# Altium project SIPROKAR_Mainboard.PrjPcb
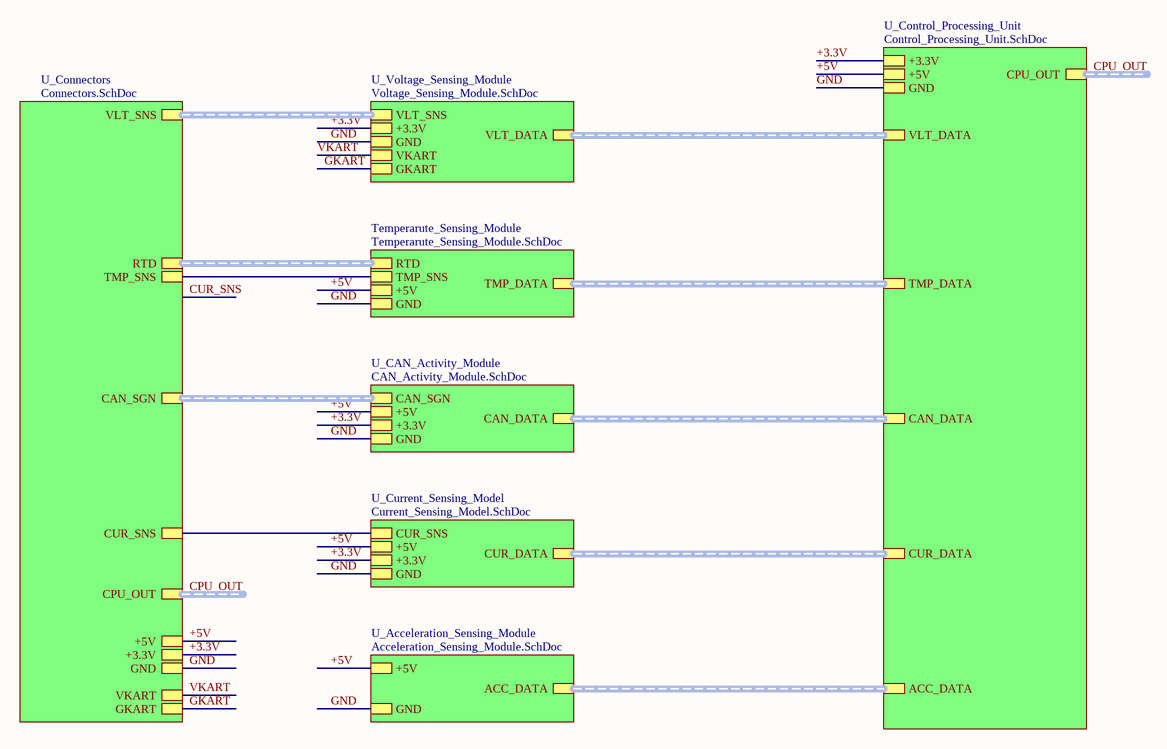
[diagram p0: Top_Level.SchDoc]
14 sheets, 185 parts. Net scope: hierarchical (ports join the sheet entries above them; power ports are global).
Board files: MainboardV2.PcbDoc, Mainboard.PcbDoc
Sheets:
  Top_Level.SchDoc
    U_Control_Processing_Unit = Control_Processing_Unit.SchDoc
    U_Current_Sensing_Model = Current_Sensing_Model.SchDoc
      Interface_Current_Sensor_1 = Interface_Current_Sensor_1.SchDoc
      U_Interface_Current_Sensor_2 = Interface_Current_Sensor_2.SchDoc
    U_CAN_Activity_Module = CAN_Activity_Module.SchDoc
      Interface_CAN_1 = Interface_CAN.SchDoc
      Interface_CAN_2 = Interface_CAN.SchDoc
    U_Connectors = Connectors.SchDoc
    U_Voltage_Sensing_Module = Voltage_Sensing_Module.SchDoc
      Interface_Voltage_Sensor_2 = Interface_Voltage_Sensor_1.SchDoc
      nterface_Voltage_Sensor_1 = Interface_Voltage_Sensor_1.SchDoc
  Interface_Accelerometer_1.SchDoc
  Interface_Accelerometer_2.SchDoc
  Interace_PT100.SchDoc
  Interface_DS18B20.SchDoc

## Sheet Top_Level.SchDoc
size A4

### Sub-sheets
Temperarute_Sensing_Module = Temperarute_Sensing_Module.SchDoc (file not in this document): GND, +5V, TMP_DATA (harness TEMP), RTD, TMP_SNS
U_Acceleration_Sensing_Module = Acceleration_Sensing_Module.SchDoc (file not in this document): GND, +5V, ACC_DATA (harness ACCELERATION DATA)
U_CAN_Activity_Module = CAN_Activity_Module.SchDoc: GND, +5V, +3.3V, CAN_DATA (harness CAN DATA), CAN_SGN (harness *)
U_Connectors = Connectors.SchDoc: CUR_SNS, RTD (harness *), TMP_SNS, VLT_SNS (harness VLT SENSE), +5V, +3.3V, GND, GKART, VKART, CAN_SGN (harness CAN SIGNALS), CPU_OUT (harness CPU)
U_Control_Processing_Unit = Control_Processing_Unit.SchDoc: TMP_DATA (harness TEMPERATURE), CUR_DATA (harness CURRENT), ACC_DATA (harness ACCELERATION), CAN_DATA (harness BUS CAN), +3.3V, +5V, GND, VLT_DATA (harness VOLTAGE DATA), CPU_OUT (harness CPU)
U_Current_Sensing_Model = Current_Sensing_Model.SchDoc: GND, +5V, CUR_DATA (harness CURRENT DATA), +3.3V, CUR_SNS
U_Voltage_Sensing_Module = Voltage_Sensing_Module.SchDoc: GND, VLT_DATA (harness VOLTAGE DATA), +3.3V, VKART, GKART, VLT_SNS

### Nets
+3.3V: sheet U_Control_Processing_Unit/+3.3V, sheet U_Current_Sensing_Model/+3.3V, sheet U_CAN_Activity_Module/+3.3V, sheet U_Connectors/+3.3V, sheet U_Voltage_Sensing_Module/+3.3V
+5V: sheet Temperarute_Sensing_Module/+5V, sheet U_Control_Processing_Unit/+5V, sheet U_Acceleration_Sensing_Module/+5V, sheet U_Current_Sensing_Model/+5V, sheet U_CAN_Activity_Module/+5V, sheet U_Connectors/+5V
GKART: sheet U_Connectors/GKART, sheet U_Voltage_Sensing_Module/GKART
GND: sheet Temperarute_Sensing_Module/GND, sheet U_Control_Processing_Unit/GND, sheet U_Acceleration_Sensing_Module/GND, sheet U_Current_Sensing_Model/GND, sheet U_CAN_Activity_Module/GND, sheet U_Connectors/GND, sheet U_Voltage_Sensing_Module/GND
VKART: sheet U_Connectors/VKART, sheet U_Voltage_Sensing_Module/VKART  [project net KVCC]
CUR_2_VAL: sheet U_Current_Sensing_Model/CUR_SNS, sheet U_Connectors/CUR_SNS
DATA: sheet Temperarute_Sensing_Module/TMP_SNS, sheet U_Connectors/TMP_SNS

### Buses and harness runs
harness CPU_OUT = sheet U_Connectors/CPU_OUT
harness CPU_OUT = sheet U_Control_Processing_Unit/CPU_OUT
harness sheet Temperarute_Sensing_Module/RTD = sheet U_Connectors/RTD
harness sheet Temperarute_Sensing_Module/TMP_DATA = sheet U_Control_Processing_Unit/TMP_DATA
harness sheet U_Acceleration_Sensing_Module/ACC_DATA = sheet U_Control_Processing_Unit/ACC_DATA
harness sheet U_CAN_Activity_Module/CAN_DATA = sheet U_Control_Processing_Unit/CAN_DATA
harness sheet U_CAN_Activity_Module/CAN_SGN = sheet U_Connectors/CAN_SGN
harness sheet U_Connectors/VLT_SNS = sheet U_Voltage_Sensing_Module/VLT_SNS
harness sheet U_Control_Processing_Unit/CUR_DATA = sheet U_Current_Sensing_Model/CUR_DATA
harness sheet U_Control_Processing_Unit/VLT_DATA = sheet U_Voltage_Sensing_Module/VLT_DATA

## Sheet Control_Processing_Unit.SchDoc
size A2
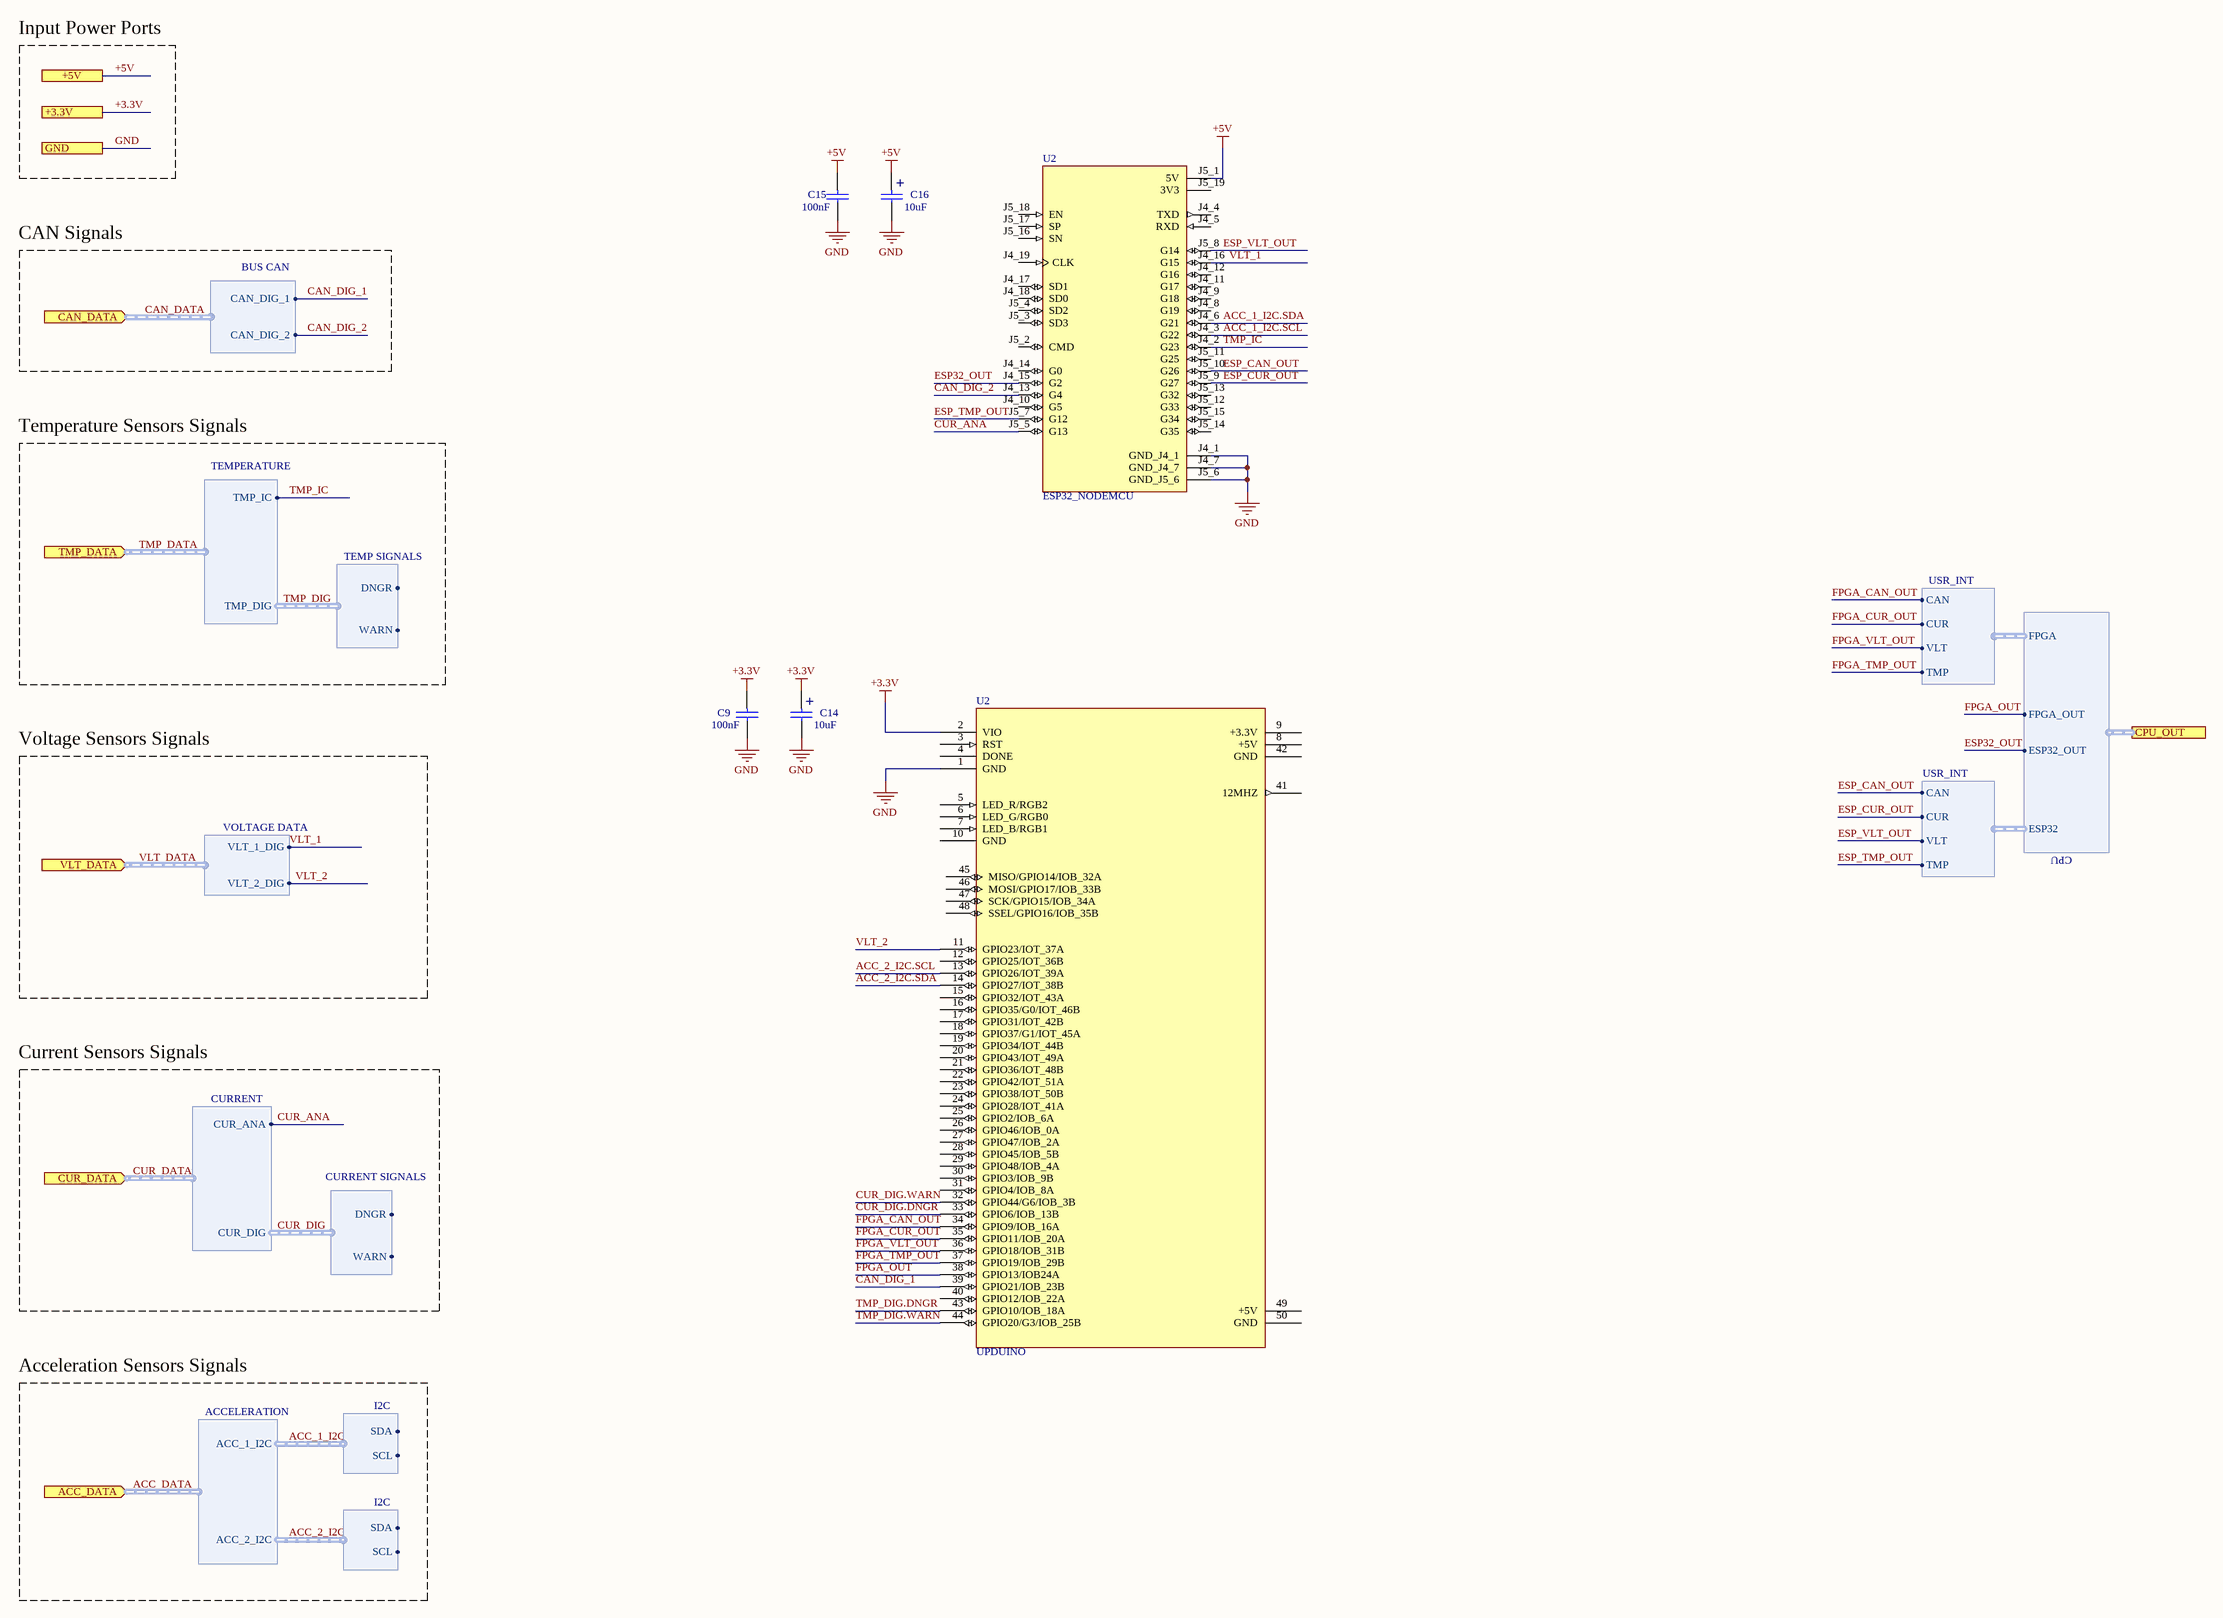
[diagram p1: Control_Processing_Unit.SchDoc]

### Parts
(Parts that share a designator on the sheet are numbered #1, #2 ... from top to bottom, then left to right.)
C9  100nF  [CAP200]
C14  10uF  [CAP100RP]
C15  100nF  [CAP200]
C16  10uF  [CAP100RP]
U2#1  ESP32_NODEMCU  [MODULE_ESP32_NODEMCU]
U2#2  UPDUINO  [UPDUINO]

### Ports
+3.3V, +5V, ACC_DATA (in, harness ACCELERATION), CAN_DATA (in, harness BUS CAN), CPU_OUT (harness CPU), CUR_DATA (in, harness CURRENT), GND, TMP_DATA (in, harness TEMPERATURE), VLT_DATA (in, harness VOLTAGE DATA)

### Harnesses
TEMPERATURE: TMP_DIG, TMP_IC
VOLTAGE DATA: VLT_2_DIG, VLT_1_DIG
CURRENT SIGNALS: WARN, DNGR
CURRENT: CUR_DIG, CUR_ANA
I2C: SCL, SDA
ACCELERATION: ACC_2_I2C, ACC_1_I2C
BUS CAN: CAN_DIG_2, CAN_DIG_1
TEMP SIGNALS: WARN, DNGR
USR_INT: CUR, VLT, TMP, CAN
CPU: FPGA, ESP32, ESP32_OUT, FPGA_OUT

### Nets
+3.3V: C9.1 C14.1 U2#2.2(VIO) ; port +3.3V
+5V: C15.1 C16.1 U2#1.J5_1(5V) ; port +5V
GND: C9.2 C14.2 C15.2 C16.2 U2#1.J4_1(GND_J4_1) U2#1.J4_7(GND_J4_7) U2#1.J5_6(GND_J5_6) U2#2.1(GND) ; port GND
ACC_1_I2C.SCL: U2#1.J4_3(G22)
ACC_1_I2C.SDA: U2#1.J4_6(G21)
ACC_2_I2C.SCL: U2#2.13(GPIO26/IOT_39A)
ACC_2_I2C.SDA: U2#2.14(GPIO27/IOT_38B)
CAN_DIG_1: U2#2.39(GPIO21/IOB_23B)
CAN_DIG_2: U2#1.J4_13(G4)
CUR_ANA: U2#1.J5_5(G13) ; port CUR_DATA.CUR_ANA  [project net CUR_1_VAL]
CUR_DIG.DNGR: U2#2.33(GPIO6/IOB_13B)
CUR_DIG.WARN: U2#2.32(GPIO44/G6/IOB_3B)
ESP32_OUT: U2#1.J4_15(G2)
ESP_CAN_OUT: U2#1.J5_10(G26) ; harness USR_INT.CAN
ESP_CUR_OUT: U2#1.J5_9(G27) ; harness USR_INT.CUR
ESP_TMP_OUT: U2#1.J5_7(G12) ; harness USR_INT.TMP
ESP_VLT_OUT: U2#1.J5_8(G14) ; harness USR_INT.VLT
FPGA_CAN_OUT: U2#2.34(GPIO9/IOB_16A) ; harness USR_INT.CAN
FPGA_CUR_OUT: U2#2.35(GPIO11/IOB_20A) ; harness USR_INT.CUR
FPGA_OUT: U2#2.38(GPIO13/IOB24A)
FPGA_TMP_OUT: U2#2.37(GPIO19/IOB_29B) ; harness USR_INT.TMP
FPGA_VLT_OUT: U2#2.36(GPIO18/IOB_31B) ; harness USR_INT.VLT
TMP_DIG.DNGR: U2#2.43(GPIO10/IOB_18A)
TMP_DIG.WARN: U2#2.44(GPIO20/G3/IOB_25B)
TMP_IC: U2#1.J4_2(G23) ; port TMP_DATA.TMP_IC  [project net TMP_DATA.TMP_IC]
VLT_1: U2#1.J4_16(G15) ; port VLT_DATA.VLT_1_DIG
VLT_2: U2#2.11(GPIO23/IOT_37A)

Not connected (* = marked no-connect by the designer): U2#1 J4_4(TXD) J4_5(RXD) J4_8(G19) J4_9(G18) J4_10(G5) J4_11(G17) J4_12(G16) J4_14(G0) J4_17(SD1) J4_18(SD0) J4_19(CLK) J5_2(CMD) J5_3(SD3) J5_4(SD2) J5_11(G25) J5_12(G33) J5_13(G32) J5_14(G35) J5_15(G34) J5_16(SN) J5_17(SP) J5_18(EN) J5_19(3V3); U2#2 3(RST) 4(DONE) 5(LED_R/RGB2) 6(LED_G/RGB0) 7(LED_B/RGB1) 8(+5V) 9(+3.3V) 10(GND) 12(GPIO25/IOT_36B) 15(GPIO32/IOT_43A) 16(GPIO35/G0/IOT_46B) 17(GPIO31/IOT_42B) 18(GPIO37/G1/IOT_45A) 19(GPIO34/IOT_44B) 20(GPIO43/IOT_49A) 21(GPIO36/IOT_48B) 22(GPIO42/IOT_51A) 23(GPIO38/IOT_50B) 24(GPIO28/IOT_41A) 25(GPIO2/IOB_6A) 26(GPIO46/IOB_0A) 27(GPIO47/IOB_2A) 28(GPIO45/IOB_5B) 29(GPIO48/IOB_4A) 30(GPIO3/IOB_9B) 31(GPIO4/IOB_8A) 40(GPIO12/IOB_22A) 41(12MHZ) 42(GND) 45(MISO/GPIO14/IOB_32A) 46(MOSI/GPIO17/IOB_33B) 47(SCK/GPIO15/IOB_34A) 48(SSEL/GPIO16/IOB_35B) 49(+5V) 50(GND)

### Buses and harness runs
harness ACC_DATA = port ACC_DATA
harness CAN_DATA = port CAN_DATA
harness CUR_DATA = port CUR_DATA
harness TMP_DATA = port TMP_DATA
harness VLT_DATA = port VLT_DATA

### Notes on the sheet
- Input Power Ports
- CAN Signals
- Temperature Sensors Signals
- Voltage Sensors Signals
- Current Sensors Signals
- Acceleration Sensors Signals
- (in symbol CMP-001-00092-1) +

### Library data of the parts
C9 C15 = CMP-001-00091-1: Source: Schematics.SchLib; Pins: 2; Design Item ID: CAP; Component Type: Standard
C14 C16 = CMP-001-00092-1: Source: Schematics.SchLib; Component Type: Standard; Pins: 2; Design Item ID: CAPPOL
U2#1 = CMP-027-000000-1: NodeMCU is an open source loT platform. ESP32 is a series of low cost, low powersystem-on-chip (SoC) microcontrollers with integrated Wi-Fi & dual-mode Bluetooth.; MF: Espressif Systems; MP: ESP32 NODEMCU; Package: Package; Design Item ID: ESP32_NODEMCU; Source: ESP32_NODEMCU.SchLib; Check_prices: https://www.snapeda.com/parts/ESP32%20NODEMCU/Espressif+Systems/view-part/?ref=eda; SnapEDA_Link: https://www.snapeda.com/parts/ESP32%20NODEMCU/Espressif+Systems/view-part/?ref=snap; Value: *; Pin Count: 38; Component Type: Standard
U2#2 = UPDUINO: Lattice UltraPlus ICE40UP5K FPGA with 5.3K LUTs, 1Mb SPRAM, 120Kb DPRAM, 8 Multipliers

## Sheet Current_Sensing_Model.SchDoc
size A4
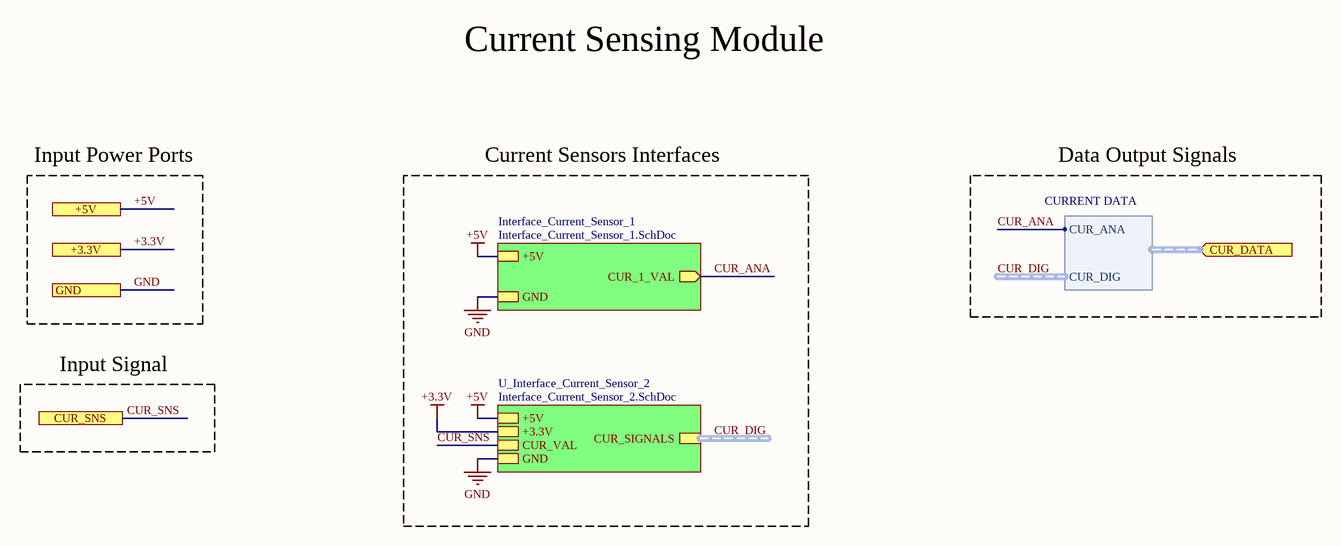
[diagram p2: Current_Sensing_Model.SchDoc]

### Sub-sheets
Interface_Current_Sensor_1 = Interface_Current_Sensor_1.SchDoc: GND, +5V, CUR_1_VAL (out)
U_Interface_Current_Sensor_2 = Interface_Current_Sensor_2.SchDoc: GND, +5V, +3.3V, CUR_SIGNALS (harness CURRENT SIGNALS), CUR_VAL

### Ports
+3.3V, +5V, CUR_DATA (in, harness CURRENT DATA), CUR_SNS, GND

### Harnesses
CURRENT DATA: CUR_ANA, CUR_DIG

### Nets
+3.3V: port +3.3V, sheet U_Interface_Current_Sensor_2/+3.3V
+5V: port +5V, sheet Interface_Current_Sensor_1/+5V, sheet U_Interface_Current_Sensor_2/+5V
GND: port GND, sheet Interface_Current_Sensor_1/GND, sheet U_Interface_Current_Sensor_2/GND
CUR_ANA: sheet Interface_Current_Sensor_1/CUR_1_VAL, port CUR_DATA.CUR_ANA  [project net CUR_1_VAL]
CUR_SNS: port CUR_SNS, sheet U_Interface_Current_Sensor_2/CUR_VAL  [project net CUR_2_VAL]

### Buses and harness runs
harness CUR_DIG = sheet U_Interface_Current_Sensor_2/CUR_SIGNALS

### Notes on the sheet
- Current Sensing Module
- Input Power Ports
- Current Sensors Interfaces
- Data Output Signals
- Input Signal

## Sheet Interface_Current_Sensor_1.SchDoc
size A4
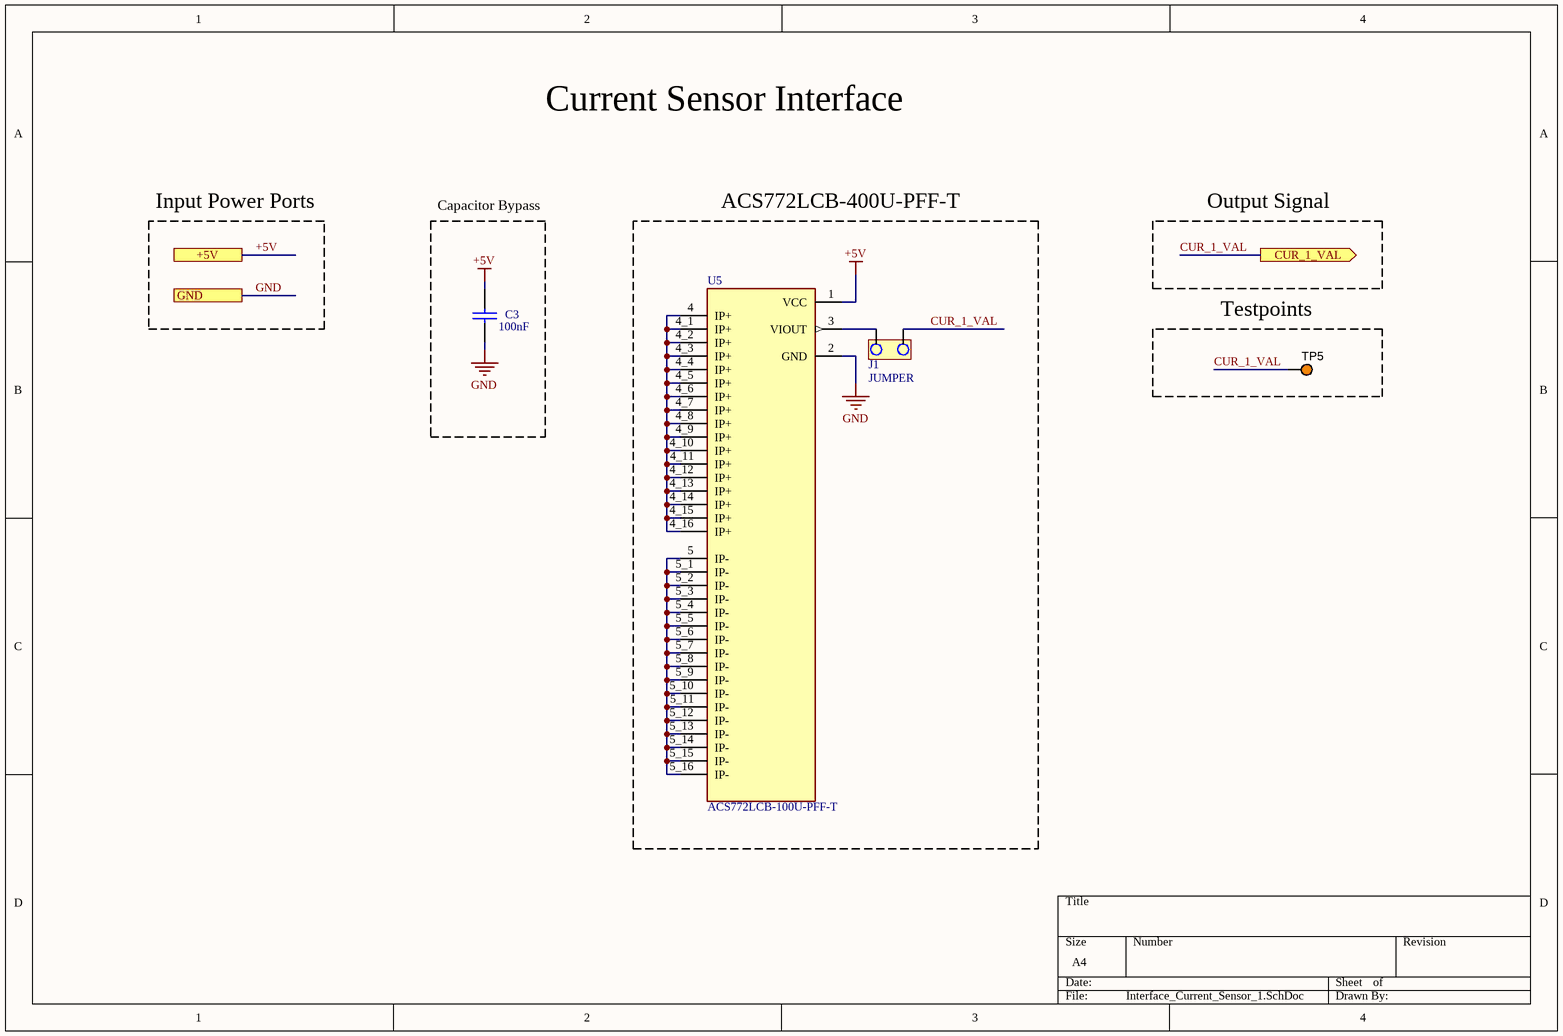
[diagram p3: Interface_Current_Sensor_1.SchDoc]

### Parts
C3  100nF  [CAP200]
J1  JUMPER  [JUMPER2]
TP5  5003  [KSTN-5003]  (value not drawn)
U5  ACS772LCB-100U-PFF-T  [XDCR_ACS772LCB-100U-PFF-T]

### Blocks framed on the sheet
Capacitor Bypass: C3
ACS772LCB-400U-PFF-T: J1 U5
Testpoints: TP5

### Ports
+5V, CUR_1_VAL (out), GND

### Nets
+5V: C3.1 U5.1(VCC) ; port +5V
GND: C3.2 U5.2(GND) ; port GND
CUR_1_VAL: J1.2 TP5.1 ; port CUR_1_VAL
NetJ1_1: J1.1 U5.3(VIOUT)
NetU5_4: U5.4(IP+) U5.4_1(IP+) U5.4_2(IP+) U5.4_3(IP+) U5.4_4(IP+) U5.4_5(IP+) U5.4_6(IP+) U5.4_7(IP+) U5.4_8(IP+) U5.4_9(IP+) U5.4_10(IP+) U5.4_11(IP+) U5.4_12(IP+) U5.4_13(IP+) U5.4_14(IP+) U5.4_15(IP+) U5.4_16(IP+)
NetU5_5: U5.5(IP-) U5.5_1(IP-) U5.5_2(IP-) U5.5_3(IP-) U5.5_4(IP-) U5.5_5(IP-) U5.5_6(IP-) U5.5_7(IP-) U5.5_8(IP-) U5.5_9(IP-) U5.5_10(IP-) U5.5_11(IP-) U5.5_12(IP-) U5.5_13(IP-) U5.5_14(IP-) U5.5_15(IP-) U5.5_16(IP-)

### Notes on the sheet
- Current Sensor Interface
- Input Power Ports
- Output Signal

### Library data of the parts
C3 = CAP
TP5 = CMP-002-00037-2: Test Point, Orange, Height 4.6 mm, Tail Length 3 mm, 1-Pin THD, RoHS; Manufacturer: Keystone; Colour: Orange; Packaging: Bulk; Package Description: 1-Pin Through Hole Device, Dia 2.54 mm; Pins: 1; Package Reference: 5003; Datasheet Version: Jun-15; Case/Package: 5003; Mounting Technology: TH; Connector Type: TestPoint; Diameter: 2.54mm; Contact Material: Bronze; Datasheet URL: http://keyelco.com/userAssets/file/M65p56.pdf; Manufacturer URL: http://www.keyelco.com/; Package Quantity: 10; Contact Plating: Tin; RoHS Compliant: True
U5 = CMP-029-000000-1: Current Sensor 100A 1 Channel Hall Effect Unidirectional 5-CB Formed Leads, PFF; MF: Allegro MicroSystems LLC; Check_prices: https://www.snapeda.com/parts/ACS772LCB-100U-PFF-T/Allegro%20MicroSystems%20LLC/view-part/2783431/?ref=eda; Availability: Bad; Arrow_Electronics-Purchase-URL: https://snapeda.com/shop?store=Arrow+Electronics&id=2783431; Value: *; Package: 5-CB-5 Allegro MicroSystems LLC; Source: ACS772LCB-100U-PFF-T.SchLib; Price: None; Design Item ID: ACS772LCB-100U-PFF-T; MP: ACS772LCB-100U-PFF-T; Pin Count: 37; Component Type: Standard; SnapEDA_Link: https://www.snapeda.com/parts/ACS772LCB-100U-PFF-T/Allegro%20MicroSystems%20LLC/view-part/2783431/?ref=snap

## Sheet Interface_Current_Sensor_2.SchDoc
size A3; SPICEModelCacheQYDFTYGO: <root> / <DocumentId>QYDFTYGO</DocumentId> / </root>
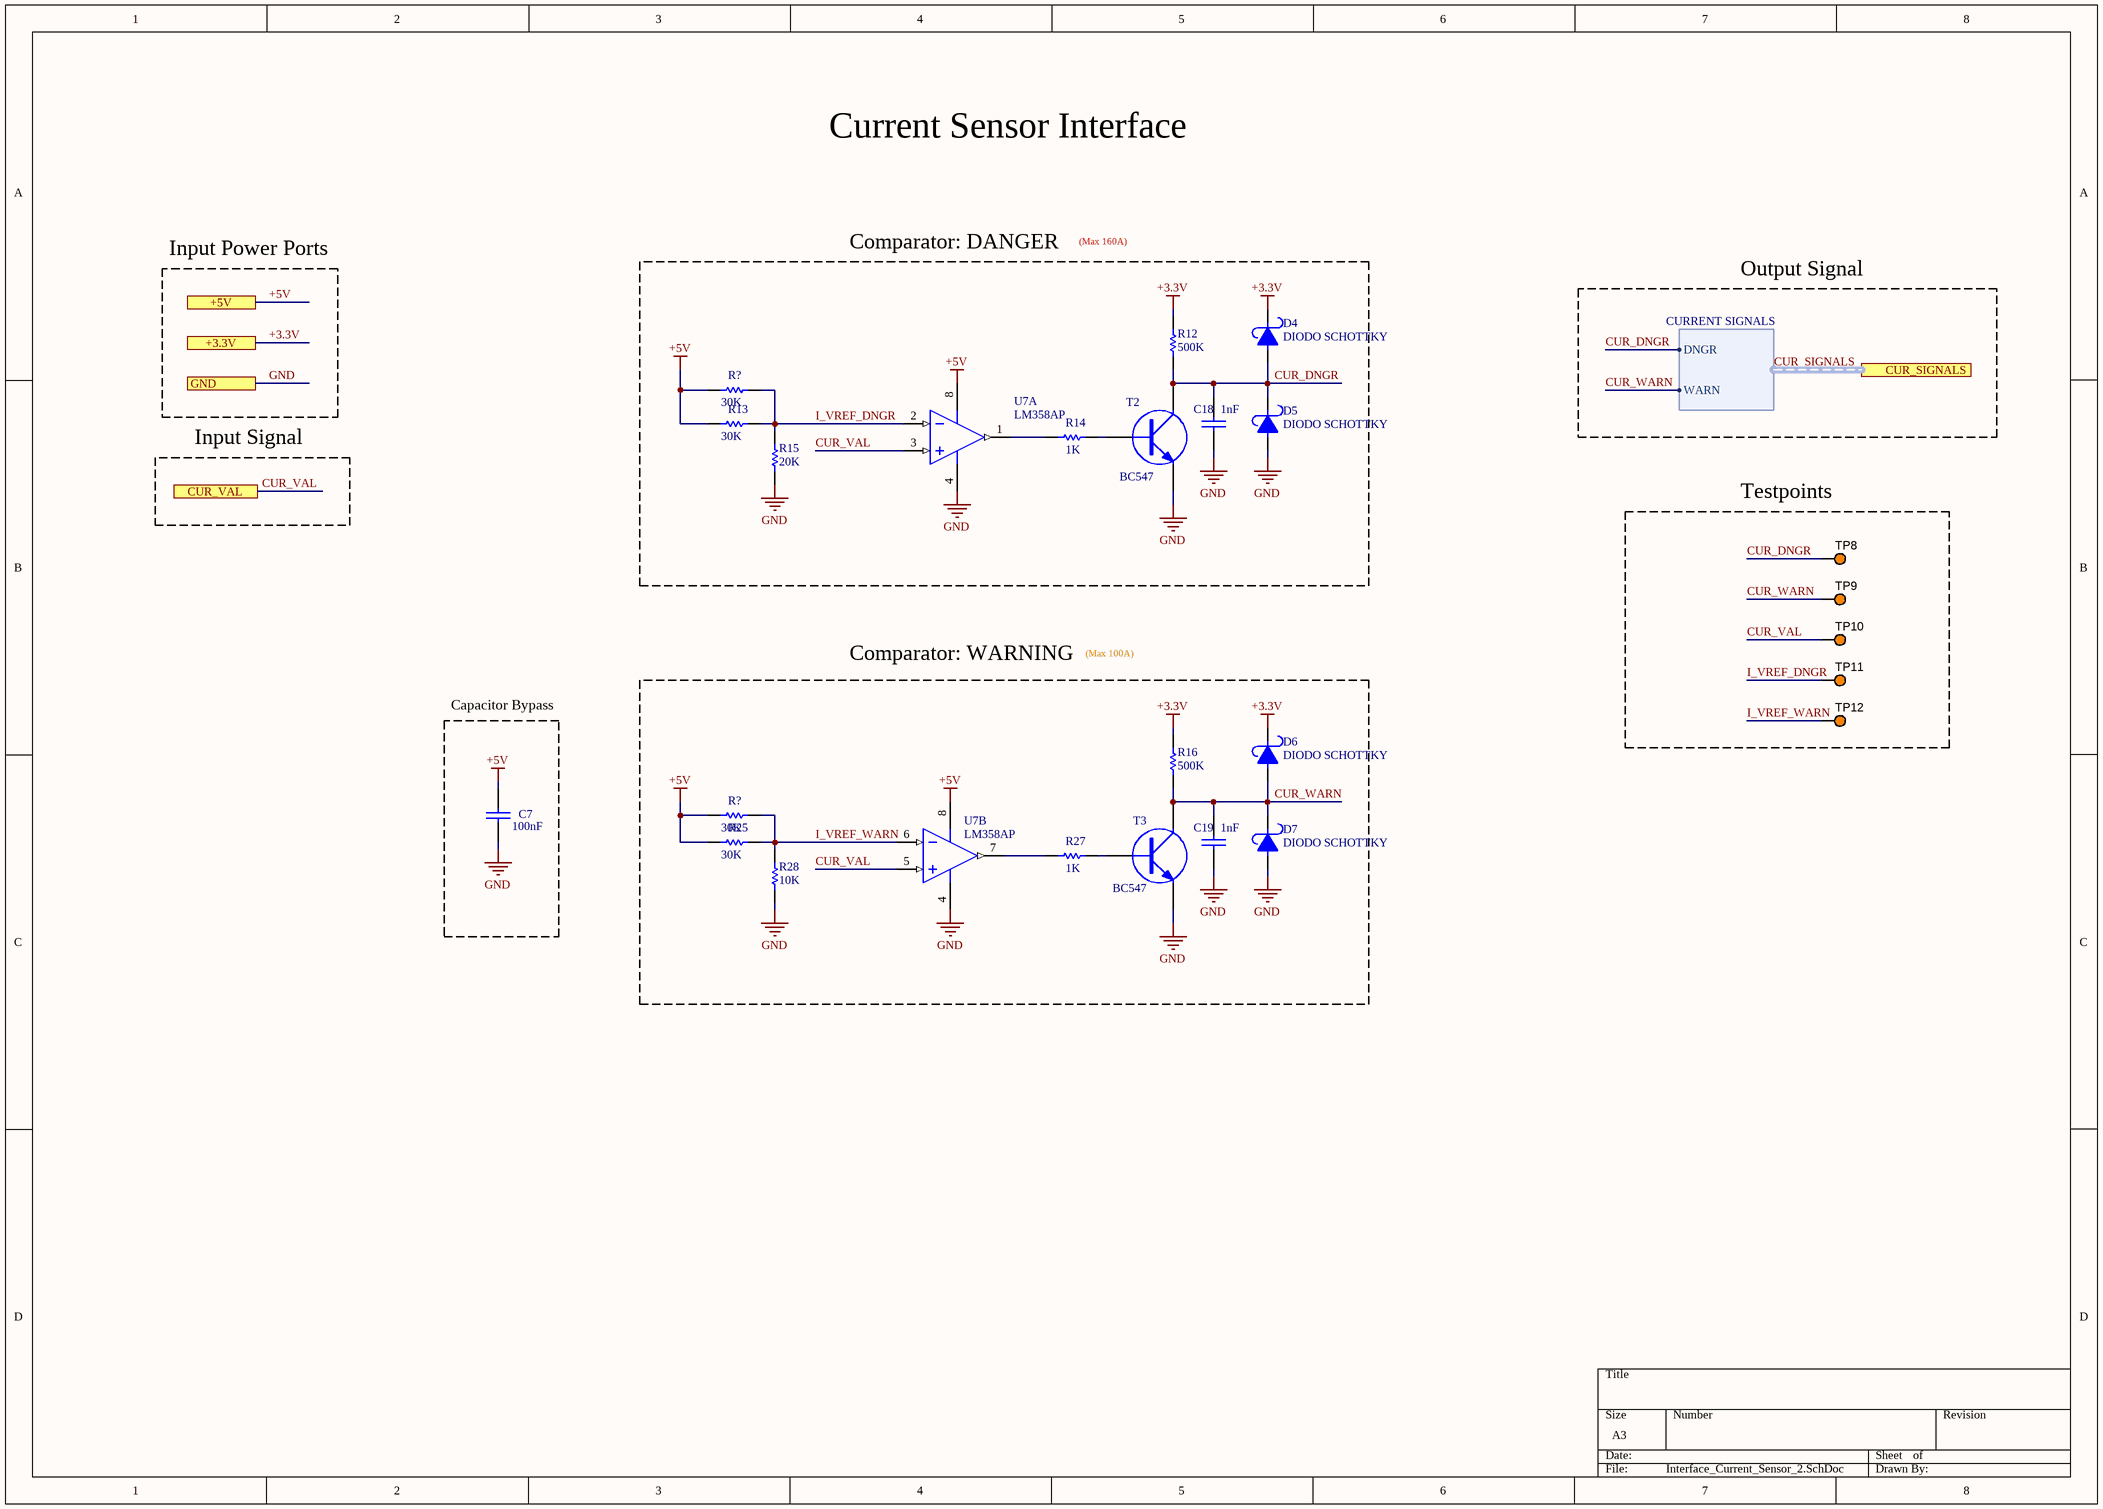
[diagram p4: Interface_Current_Sensor_2.SchDoc]

### Parts
(Parts that share a designator on the sheet are numbered #1, #2 ... from top to bottom, then left to right.)
C7  100nF  [CAP200]
C18  1nF  [CAP200]
C19  1nF  [CAP200]
D4  DIODO SCHOTTKY  [DO41]
D5  DIODO SCHOTTKY  [DO41]
D6  DIODO SCHOTTKY  [DO41]
D7  DIODO SCHOTTKY  [DO41]
R12  500K  [RES400]
R13  30K  [RES400]
R14  1K  [RES400]
R15  20K  [RES400]
R16  500K  [RES400]
R25  30K  [RES400]
R27  1K  [RES400]
R28  10K  [RES400]
R?#1  30K  [RES400]
R?#2  30K  [RES400]
T2  BC547  [TO92]
T3  BC547  [TO92]
TP8  5003  [KSTN-5003]  (value not drawn)
TP9  5003  [KSTN-5003]  (value not drawn)
TP10  5003  [KSTN-5003]  (value not drawn)
TP11  5003  [KSTN-5003]  (value not drawn)
TP12  5003  [KSTN-5003]  (value not drawn)
U7  LM358AP  [P0008A]  (parts A,B of 2)

### Blocks framed on the sheet
Comparator: DANGER: C18 D4 D5 R12-R15 R?#1 T2 U7
Testpoints: TP8-TP12
Comparator: WARNING: C19 D6 D7 R16 R25 R27 R28 R?#2 T3 U7
Capacitor Bypass: C7

### Ports
+3.3V, +5V, CUR_SIGNALS (harness CURRENT SIGNALS), CUR_VAL, GND

### Harnesses
CURRENT SIGNALS: DNGR, WARN

### Nets
+3.3V: D4.2 D6.2 R12.2 R16.2 ; port +3.3V
+5V: C7.1 R13.1 R25.1 R?#1.1 R?#2.1 U7.8(VCC) ; port +5V
GND: C7.2 C18.2 C19.2 D5.1 D7.1 R15.1 R28.1 T2.3(E) T3.3(E) U7.4(GND) ; port GND
CUR_DNGR: C18.1 D4.1 D5.2 R12.1 T2.2(C) TP8.1 ; port CUR_SIGNALS.DNGR  [project net CUR_DIG.DNGR]
CUR_VAL: TP10.1 U7.3(1IN+) U7.5(2IN+) ; port CUR_VAL  [project net CUR_2_VAL]
CUR_WARN: C19.1 D6.1 D7.2 R16.1 T3.2(C) TP9.1 ; port CUR_SIGNALS.WARN  [project net CUR_DIG.WARN]
I_VREF_DNGR: R13.2 R15.2 R?#1.2 TP11.1 U7.2(1IN-)
I_VREF_WARN: R25.2 R28.2 R?#2.2 TP12.1 U7.6(2IN-)
NetR14_1: R14.1 U7.1(1OUT)
NetR14_2: R14.2 T2.1(B)
NetR27_1: R27.1 U7.7(2OUT)
NetR27_2: R27.2 T3.1(B)

### Buses and harness runs
harness CUR_SIGNALS = port CUR_SIGNALS

### Notes on the sheet
- Current Sensor Interface
- (Max 160A)
- Input Power Ports
- Output Signal
- Input Signal
- (Max 100A)

### Library data of the parts
C7 C18 C19 = CAP
R12-R16 R25 R27 R28 R?#1 R?#2 = CMP-009-00195-1: Component Type: Standard; Source: Schematics.SchLib; Pins: 2; Design Item ID: RES
T2 T3 = CMP-012-00019-1: Component Type: Standard; Source: Schematics.SchLib; Design Item ID: TRANSISTOR NPN; Pins: 3
TP8-TP12 = CMP-002-00037-2: as TP5 on sheet Interface_Current_Sensor_1; Colour: Orange; Packaging: Bulk; Package Description: 1-Pin Through Hole Device, Dia 2.54 mm; Pins: 1; Package Reference: 5003; Datasheet Version: Jun-15; Case/Package: 5003; Mounting Technology: TH; Connector Type: TestPoint; Diameter: 2.54mm; Contact Material: Bronze; Datasheet URL: http://keyelco.com/userAssets/file/M65p56.pdf; Manufacturer URL: http://www.keyelco.com/; Package Quantity: 10; Contact Plating: Tin; RoHS Compliant: True
U7 = CMP-014-00023-2: Dual Operational Amplifier, 3 to 32 V, 0 to 70 degC, 8-Pin PDIP (P), Pb-Free (RoHS), Tube; Manufacturer: Texas Instruments (TI); Channels: 2; Max Dual Supply Voltage: 16V; Min Dual Supply Voltage: 1.5V; Slew Rate: 0.3V/us; Unity Gain Bandwidth Product: 700KHz; Common Mode Rejection Ratio: 65dB; Nominal Supply Voltage: 5V; Package Version: 4040082/E, 04/2010; Output Current: 30mA; Nominal Supply Current: 1.2mA; Nominal Voltage Gain: 100dB; Case/Package: DIP; Max Operating Temperature: 70°C; RoHS Compliant: True; Manufacturer URL: http://www.ti.com/; Pins: 8; Package Description: 8-Pin Double In-line Package, Body 9.59 x 6.35 mm, Pitch 2.54 mm; Datasheet URL: http://www.ti.com/lit/ds/symlink/lm358a.pdf; Max Supply Voltage: 16V; Package Reference: P0008A; Mounting Technology: TH; Min Operating Temperature: 0°C; Package URL: http://www.ti.com/lit/ml/mpdi001b/mpdi001b.pdf; Min Supply Voltage: 1.5V; Package Quantity: 50; Packaging: Rail/Tube; Datasheet Version: SLOS068T, 04/2015; Nominal Gain Bandwith Product: 700KHz

## Sheet CAN_Activity_Module.SchDoc
size A4; SPICEModelCacheIPUPPCIY: <root> / <DocumentId>IPUPPCIY</DocumentId> / </root>
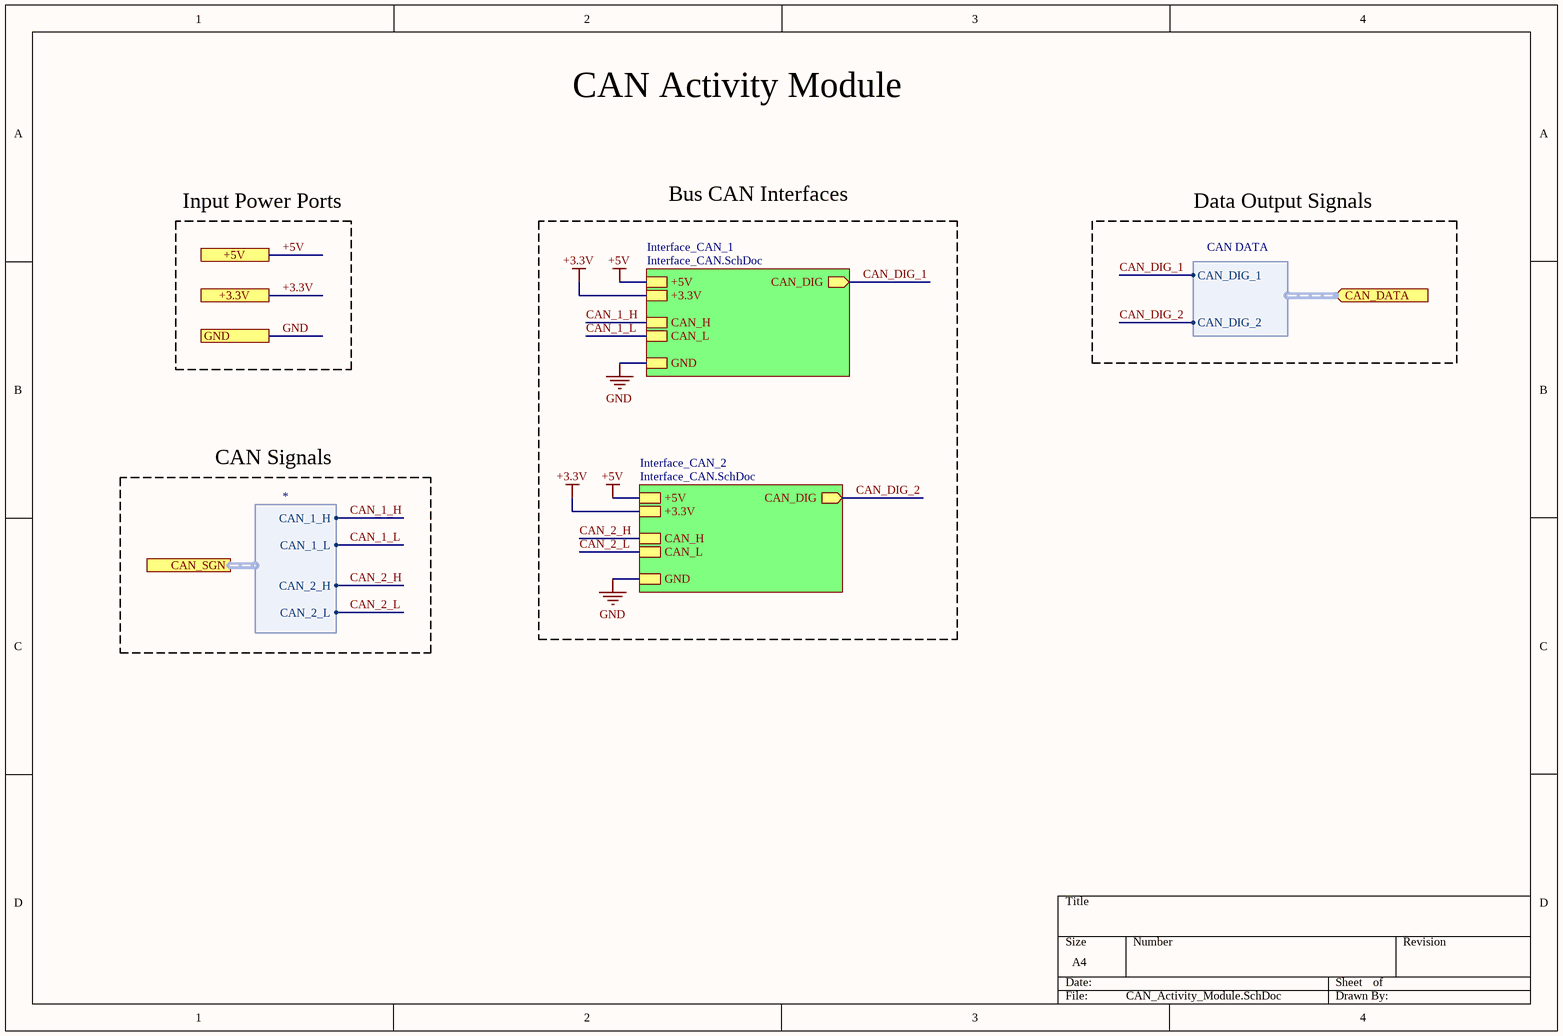
[diagram p5: CAN_Activity_Module.SchDoc]

### Sub-sheets
Interface_CAN_1 = Interface_CAN.SchDoc: GND, +5V, CAN_DIG (out), CAN_L, CAN_H, +3.3V
Interface_CAN_2 = Interface_CAN.SchDoc: GND, +5V, CAN_DIG (out), CAN_L, CAN_H, +3.3V

### Ports
+3.3V, +5V, CAN_DATA (in, harness CAN DATA), CAN_SGN (harness *), GND

### Harnesses
CAN DATA: CAN_DIG_1, CAN_DIG_2
*: CAN_1_H, CAN_1_L, CAN_2_H, CAN_2_L

### Nets
+3.3V: port +3.3V, sheet Interface_CAN_1/+3.3V, sheet Interface_CAN_2/+3.3V
+5V: port +5V, sheet Interface_CAN_1/+5V, sheet Interface_CAN_2/+5V
GND: port GND, sheet Interface_CAN_1/GND, sheet Interface_CAN_2/GND
CAN_1_H: sheet Interface_CAN_1/CAN_H, port CAN_SGN.CAN_1_H
CAN_1_L: sheet Interface_CAN_1/CAN_L, port CAN_SGN.CAN_1_L
CAN_2_H: sheet Interface_CAN_2/CAN_H, port CAN_SGN.CAN_2_H
CAN_2_L: sheet Interface_CAN_2/CAN_L, port CAN_SGN.CAN_2_L
CAN_DIG_1: sheet Interface_CAN_1/CAN_DIG, port CAN_DATA.CAN_DIG_1  [project net CAN_DATA.CAN_DIG_1]
CAN_DIG_2: sheet Interface_CAN_2/CAN_DIG, port CAN_DATA.CAN_DIG_2  [project net CAN_DATA.CAN_DIG_2]

### Notes on the sheet
- CAN Activity Module
- Input Power Ports
- Bus CAN Interfaces
- Data Output Signals
- CAN Signals

## Sheet Interface_CAN.SchDoc
size Legal; SPICEModelCacheOQIDUCOR: <root> / <DocumentId>OQIDUCOR</DocumentId> / </root>
Used 2 times, as channels U_CAN_Activity_Module/Interface_CAN_1, U_CAN_Activity_Module/Interface_CAN_2. Parts and nets are listed once, with the designators drawn on the sheet.
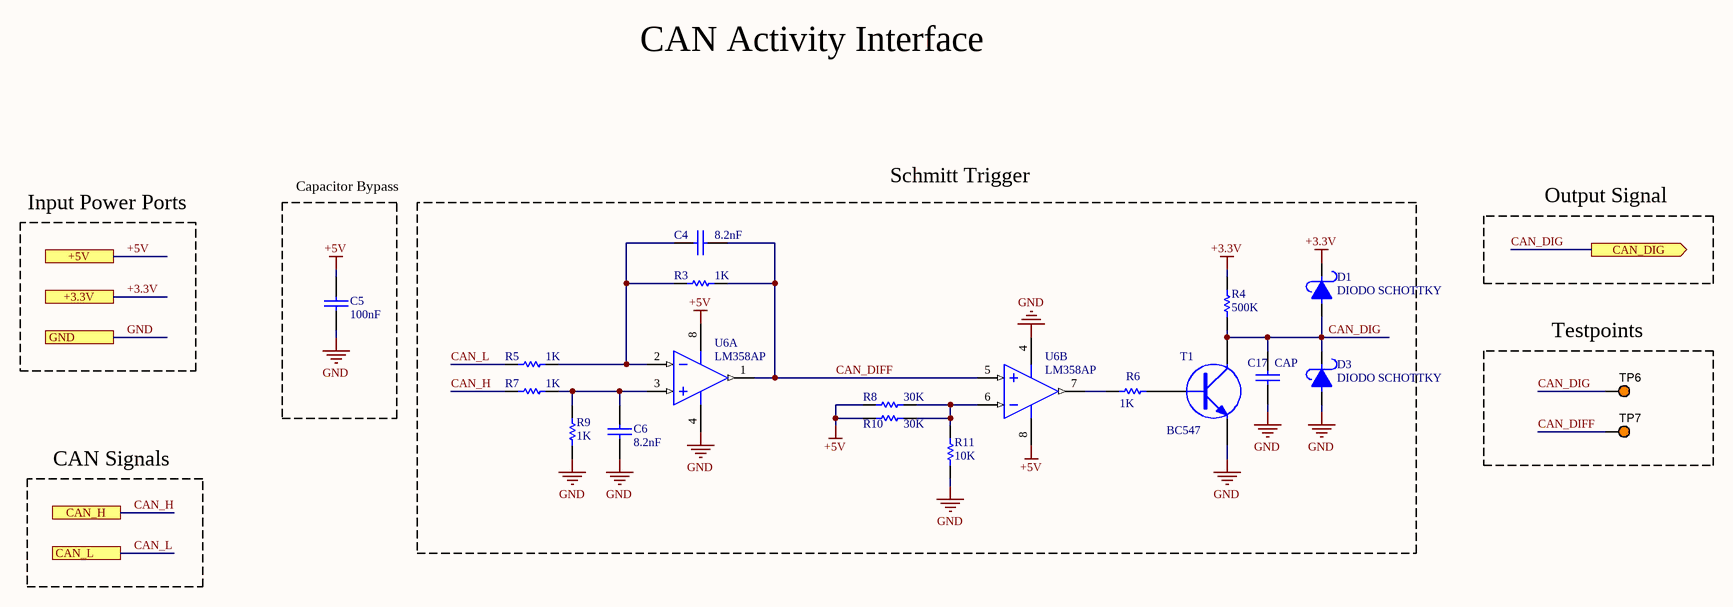
[diagram p6: Interface_CAN.SchDoc]

### Parts
C4  8.2nF  [CAP200]
C5  100nF  [CAP200]
C6  8.2nF  [CAP200]
C17  CAP  [CAP200]
D1  DIODO SCHOTTKY  [DO41]
D3  DIODO SCHOTTKY  [DO41]
R3  1K  [RES400]
R4  500K  [RES400]
R5  1K  [RES400]
R6  1K  [RES400]
R7  1K  [RES400]
R8  30K  [RES400]
R9  1K  [RES400]
R10  30K  [RES400]
R11  10K  [RES400]
T1  BC547  [TO92]
TP6  5003  [KSTN-5003]  (value not drawn)
TP7  5003  [KSTN-5003]  (value not drawn)
U6  LM358AP  [P0008A]  (parts A,B of 2)

### Blocks framed on the sheet
Capacitor Bypass: C5
Schmitt Trigger: C4 C6 C17 D1 D3 R3-R11 T1 U6
Testpoints: TP6 TP7

### Ports
+3.3V, +5V, CAN_DIG (out), CAN_H, CAN_L, GND

### Nets
+3.3V: D1.2 R4.2 ; port +3.3V
+5V: C5.1 R8.1 R10.1 U6.8(VCC) ; port +5V
GND: C5.2 C6.2 C17.2 D3.1 R9.1 R11.1 T1.3(E) U6.4(GND) ; port GND
CAN_DIFF: C4.2 R3.1 TP7.1 U6.1(1OUT) U6.5(2IN+)
CAN_DIG: C17.1 D1.1 D3.2 R4.1 T1.2(C) TP6.1 ; port CAN_DIG
CAN_H: R7.1 ; port CAN_H
CAN_L: R5.1 ; port CAN_L
NetC4_1: C4.1 R3.2 R5.2 U6.2(1IN-)
NetC6_1: C6.1 R7.2 R9.2 U6.3(1IN+)
NetR6_1: R6.1 U6.7(2OUT)
NetR6_2: R6.2 T1.1(B)
NetR8_2: R8.2 R10.2 R11.2 U6.6(2IN-)

### Channels
U_CAN_Activity_Module/Interface_CAN_1: designators end in _Interface_CAN_1; ports +3.3V=+3.3V +5V=+5V CAN_DIG=CAN_DATA.CAN_DIG_1 CAN_H=CAN_1_H CAN_L=CAN_1_L GND=GND
U_CAN_Activity_Module/Interface_CAN_2: designators end in _Interface_CAN_2; ports +3.3V=+3.3V +5V=+5V CAN_DIG=CAN_DATA.CAN_DIG_2 CAN_H=CAN_2_H CAN_L=CAN_2_L GND=GND

### Notes on the sheet
- CAN Activity Interface
- Input Power Ports
- Output Signal
- CAN Signals

### Library data of the parts
C4-C6 = CAP
R3-R11 = CMP-009-00195-1: Component Type: Standard; Source: Schematics.SchLib; Pins: 2; Design Item ID: RES
T1 = CMP-012-00019-1: Component Type: Standard; Source: Schematics.SchLib; Design Item ID: TRANSISTOR NPN; Pins: 3
TP6 TP7 = CMP-002-00037-2: as TP5 on sheet Interface_Current_Sensor_1; Colour: Orange; Packaging: Bulk; Package Description: 1-Pin Through Hole Device, Dia 2.54 mm; Pins: 1; Package Reference: 5003; Datasheet Version: Jun-15; Case/Package: 5003; Mounting Technology: TH; Connector Type: TestPoint; Diameter: 2.54mm; Contact Material: Bronze; Datasheet URL: http://keyelco.com/userAssets/file/M65p56.pdf; Manufacturer URL: http://www.keyelco.com/; Package Quantity: 10; Contact Plating: Tin; RoHS Compliant: True
U6 = CMP-014-00023-2: as U7 on sheet Interface_Current_Sensor_2; Case/Package: DIP; Max Operating Temperature: 70°C; RoHS Compliant: True; Manufacturer URL: http://www.ti.com/; Pins: 8; Package Description: 8-Pin Double In-line Package, Body 9.59 x 6.35 mm, Pitch 2.54 mm; Datasheet URL: http://www.ti.com/lit/ds/symlink/lm358a.pdf; Max Supply Voltage: 16V; Package Reference: P0008A; Mounting Technology: TH; Min Operating Temperature: 0°C; Package URL: http://www.ti.com/lit/ml/mpdi001b/mpdi001b.pdf; Min Supply Voltage: 1.5V; Package Quantity: 50; Packaging: Rail/Tube; Datasheet Version: SLOS068T, 04/2015; Nominal Gain Bandwith Product: 700KHz

## Sheet Connectors.SchDoc
size A2
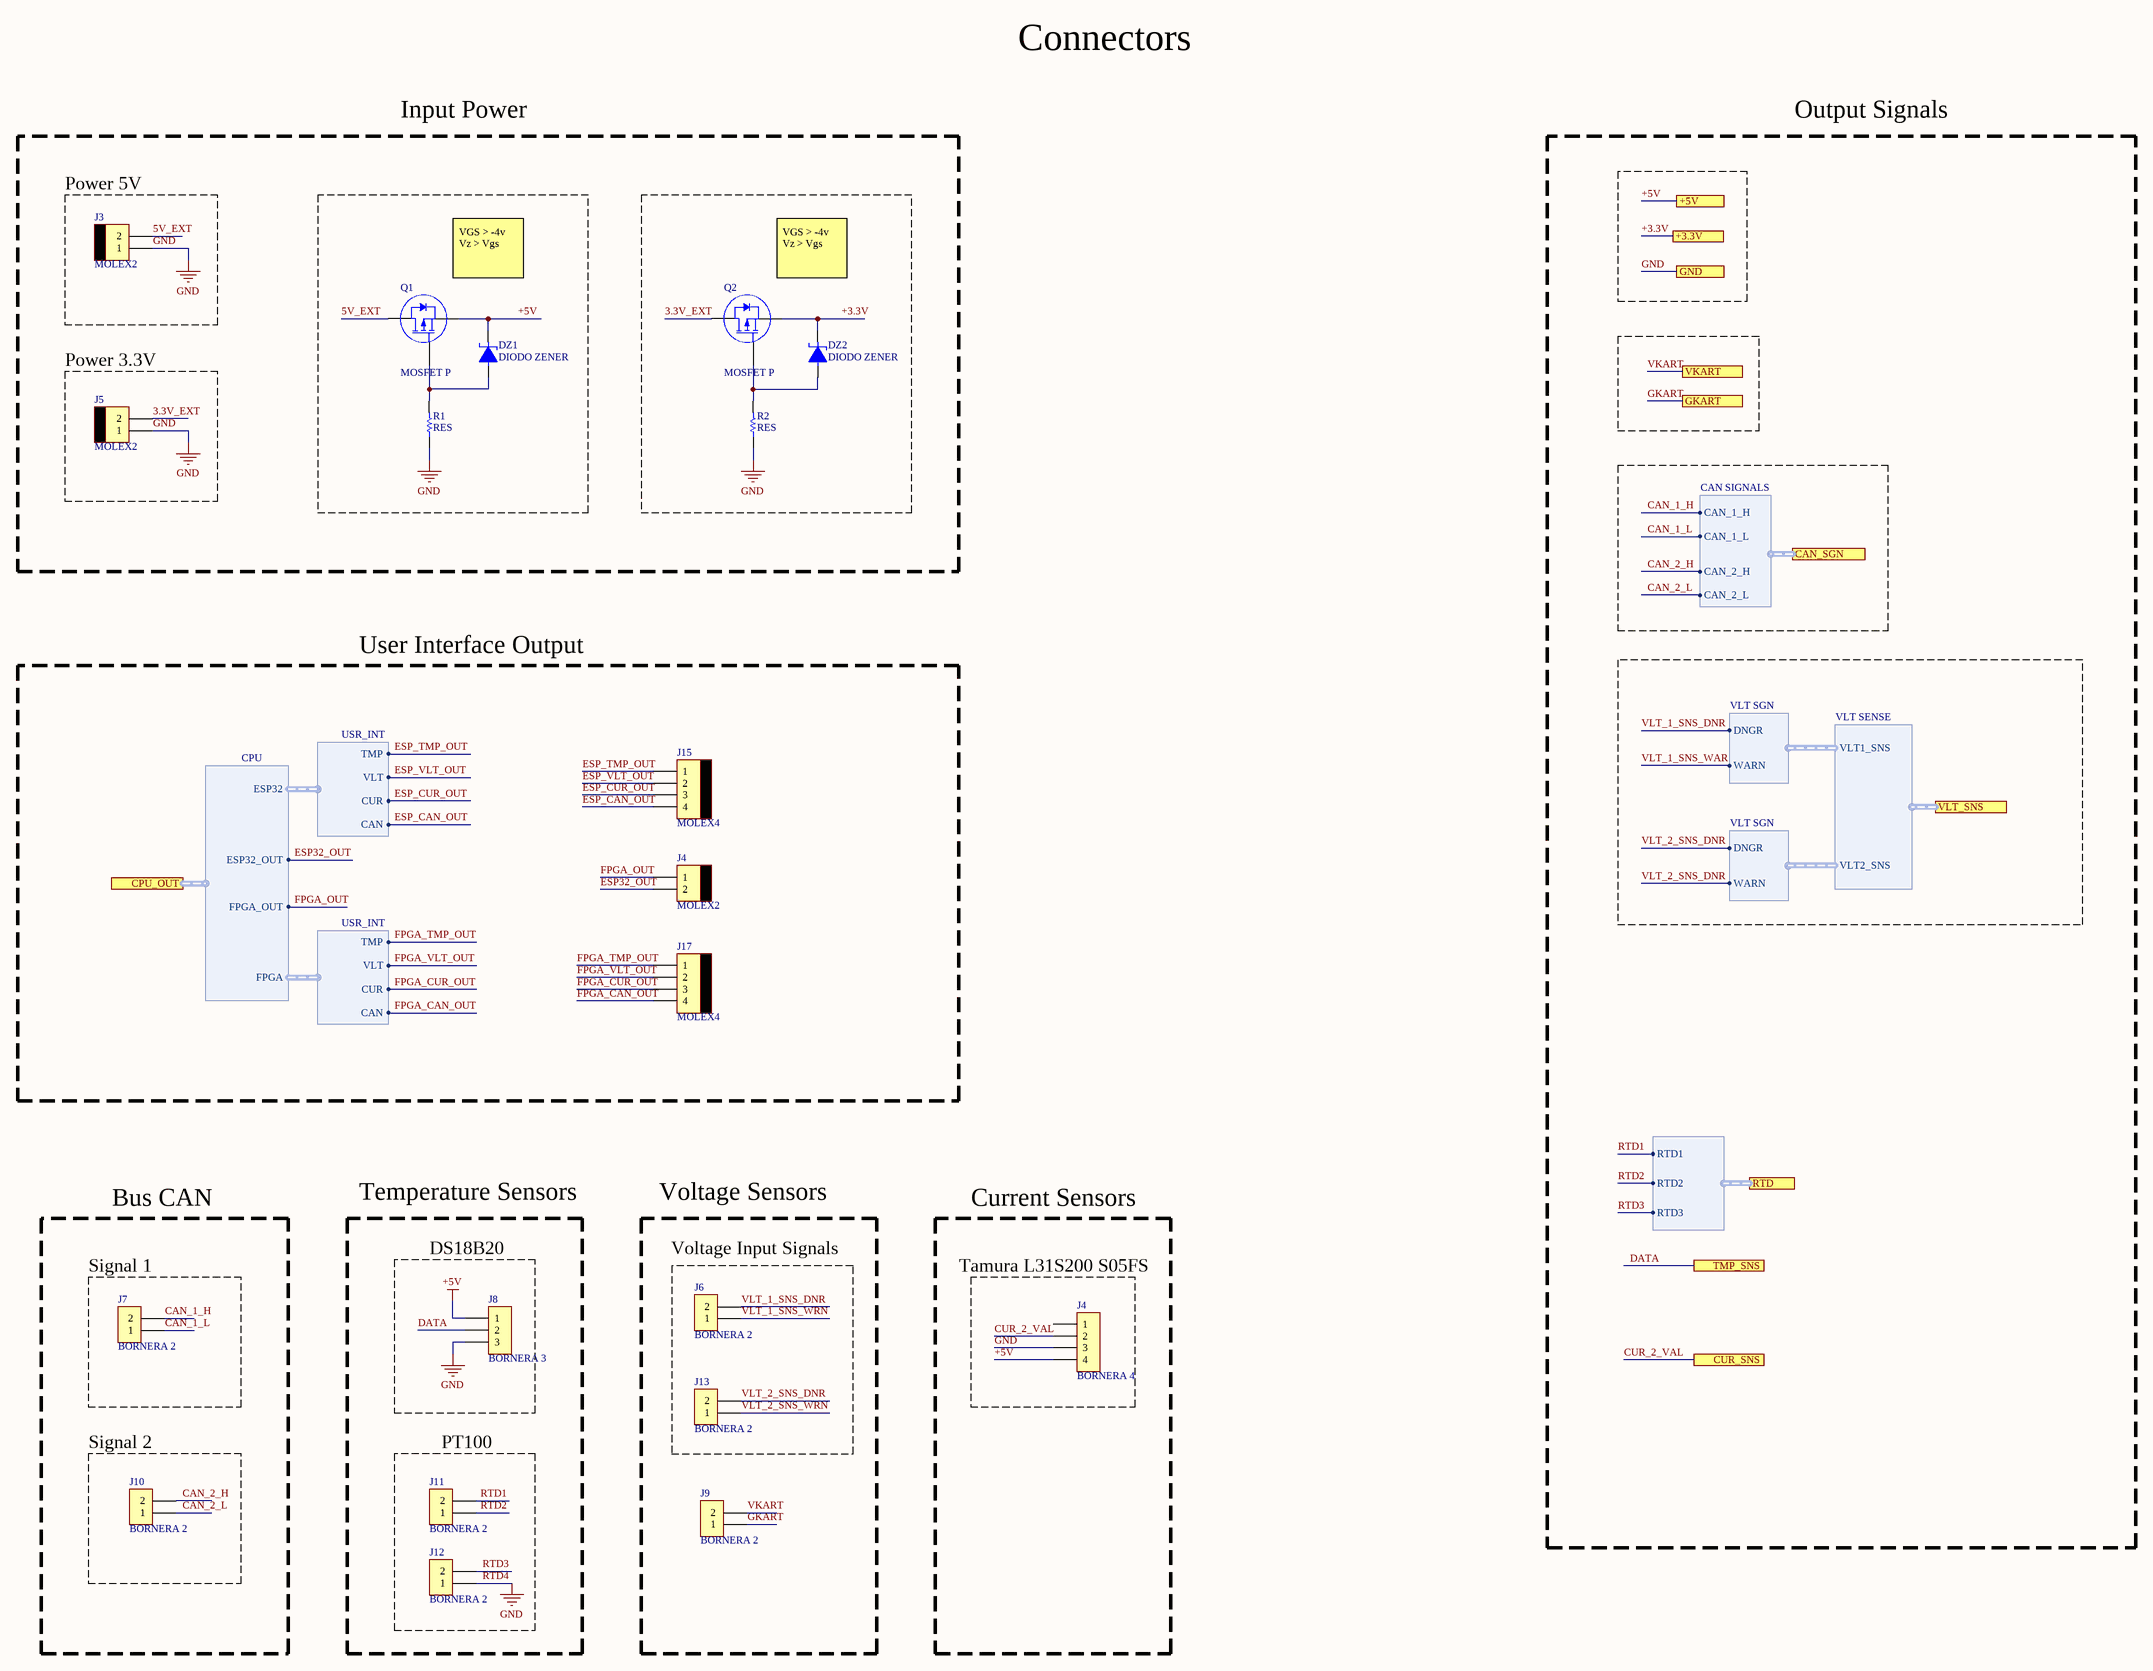
[diagram p7: Connectors.SchDoc]

### Parts
(Parts that share a designator on the sheet are numbered #1, #2 ... from top to bottom, then left to right.)
DZ1  DIODO ZENER  [DO41]
DZ2  DIODO ZENER  [DO41]
J3  MOLEX2  [MOLEX2]
J4#1  MOLEX2  [MOLEX2]
J4#2  BORNERA 4  [BORNERA4]
J5  MOLEX2  [MOLEX2]
J6  BORNERA 2  [BORNERA2]
J7  BORNERA 2  [BORNERA2]
J8  BORNERA 3  [BORNERA3]
J9  BORNERA 2  [BORNERA2]
J10  BORNERA 2  [BORNERA2]
J11  BORNERA 2  [BORNERA2]
J12  BORNERA 2  [BORNERA2]
J13  BORNERA 2  [BORNERA2]
J15  MOLEX4  [MOLEX4]
J17  MOLEX4  [MOLEX4]
Q1  MOSFET P  [TO-220 V]
Q2  MOSFET P  [TO-220 V]
R1  RES  [RES400]
R2  RES  [RES400]

### Blocks framed on the sheet
Input Power: DZ1 DZ2 Q1 Q2 R1 R2
Power 5V: J3
Power 3.3V: J5
User Interface Output: J4#1 J15 J17
Voltage Sensors: J9
Current Sensors: J4#2
Signal 1: J7
DS18B20: J8
Voltage Input Signals: J6 J13
Signal 2: J10
PT100: J11 J12

### Ports
+3.3V, +5V, CAN_SGN (harness CAN SIGNALS), CPU_OUT (harness CPU), CUR_SNS, GKART, GND, RTD (harness *), TMP_SNS, VKART, VLT_SNS (harness VLT SENSE)

### Harnesses
?: RTD1, RTD2, RTD3
CAN SIGNALS: CAN_1_H, CAN_1_L, CAN_2_H, CAN_2_L
VLT SGN: DNGR, WARN
USR_INT: CUR, VLT, TMP, CAN
CPU: FPGA, ESP32, ESP32_OUT, FPGA_OUT
VLT SENSE: VLT1_SNS, VLT2_SNS

### Nets
+3.3V: DZ2.2 Q2.3(S) ; port +3.3V
+5V: DZ1.2 J4#2.4 J8.1 Q1.3(S) ; port +5V
GKART: J9.1 ; port GKART
GND: J3.1 J4#2.3 J5.1 J8.3 J12.1 R1.1 R2.1 ; port GND  [also labelled RTD4]
VKART: J9.2 ; port VKART  [project net KVCC]
3.3V_EXT: J5.2 Q2.2(D)
5V_EXT: J3.2 Q1.2(D)
CAN_1_H: J7.2 ; port CAN_SGN.CAN_1_H
CAN_1_L: J7.1 ; port CAN_SGN.CAN_1_L
CAN_2_H: J10.2 ; port CAN_SGN.CAN_2_H
CAN_2_L: J10.1 ; port CAN_SGN.CAN_2_L
CUR_2_VAL: J4#2.2 ; port CUR_SNS
DATA: J8.2 ; port TMP_SNS
ESP32_OUT: J4#1.2
ESP_CAN_OUT: J15.4 ; harness USR_INT.CAN
ESP_CUR_OUT: J15.3 ; harness USR_INT.CUR
ESP_TMP_OUT: J15.1 ; harness USR_INT.TMP
ESP_VLT_OUT: J15.2 ; harness USR_INT.VLT
FPGA_CAN_OUT: J17.4 ; harness USR_INT.CAN
FPGA_CUR_OUT: J17.3 ; harness USR_INT.CUR
FPGA_OUT: J4#1.1
FPGA_TMP_OUT: J17.1 ; harness USR_INT.TMP
FPGA_VLT_OUT: J17.2 ; harness USR_INT.VLT
RTD1: J11.2 ; port RTD.RTD1
RTD2: J11.1 ; port RTD.RTD2
RTD3: J12.2 ; port RTD.RTD3
VLT_1_SNS_DNR: J6.2 ; harness VLT SGN.DNGR  [project net VLT1_SNS.DNGR]
VLT_1_SNS_WAR: harness VLT SGN.WARN  [project net VLT1_SNS.WARN]
VLT_1_SNS_WRN: J6.1
VLT_2_SNS_DNR: J13.2 ; harness VLT SGN.DNGR, harness VLT SGN.WARN  [project net VLT2_SNS.DNGR]
VLT_2_SNS_WRN: J13.1
NetDZ1_1: DZ1.1 Q1.1(G) R1.2
NetDZ2_1: DZ2.1 Q2.1(G) R2.2

Not connected (* = marked no-connect by the designer): J4#2 1

### Notes on the sheet
- Connectors
- Output Signals
- VGS > -4v
  Vz > Vgs
- Bus CAN
- Temperature Sensors
- Tamura L31S200 S05FS

## Sheet Voltage_Sensing_Module.SchDoc
size A4; SPICEModelCacheQEFCYNOZ: <root> / <DocumentId>QEFCYNOZ</DocumentId> / </root>
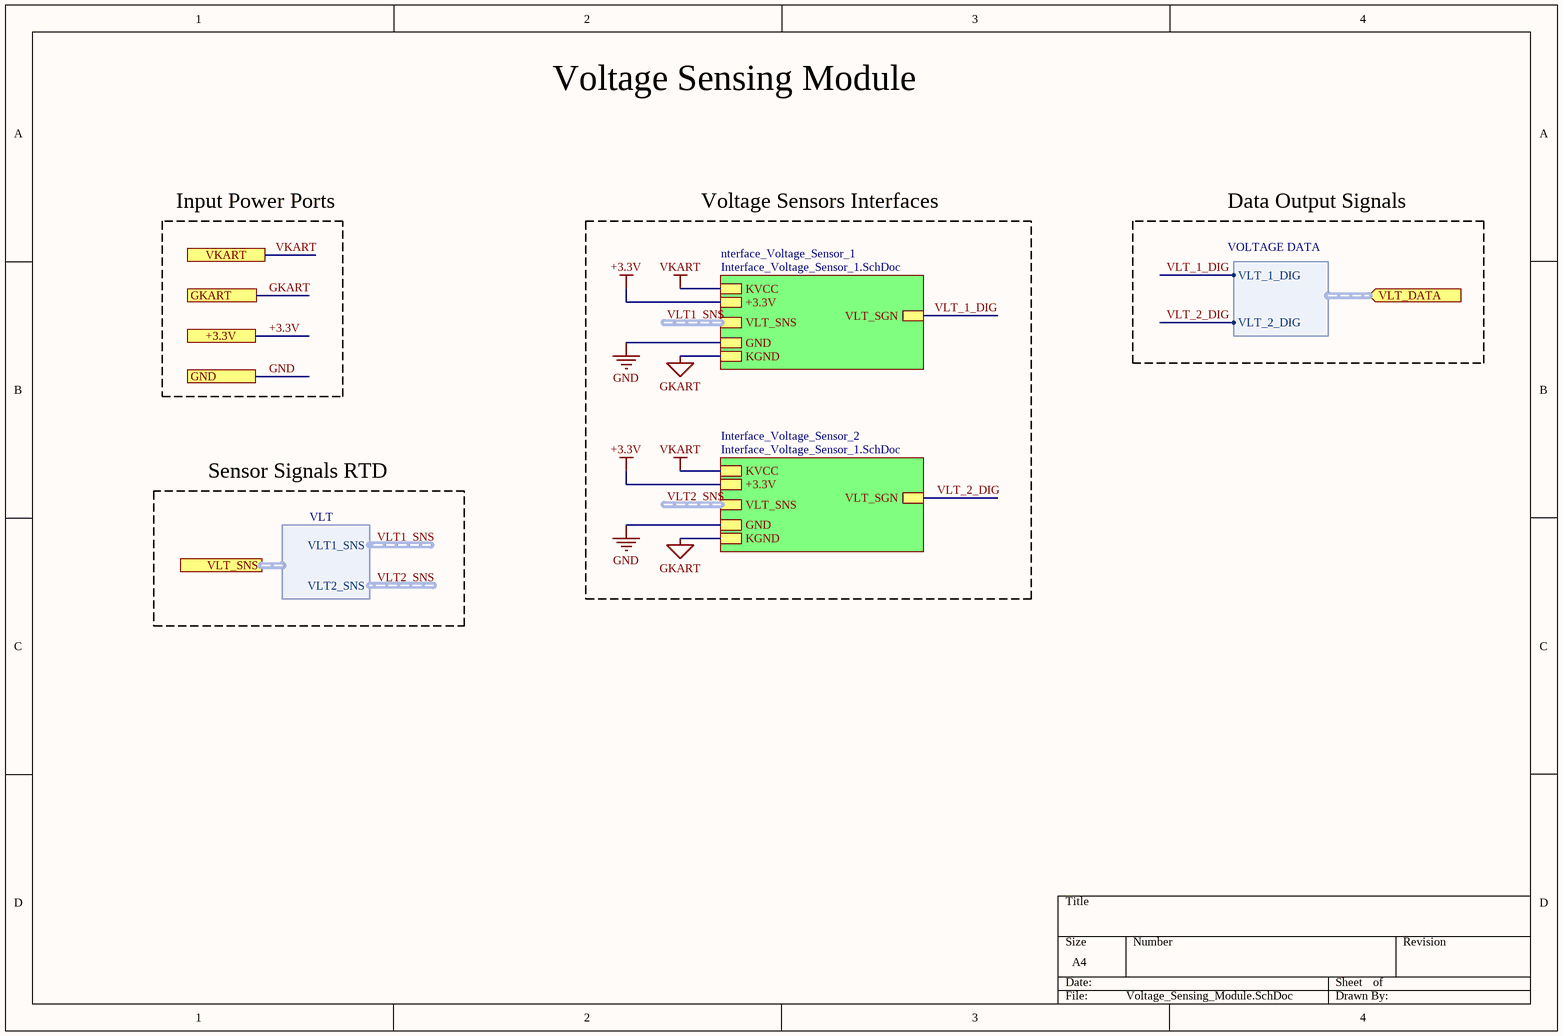
[diagram p8: Voltage_Sensing_Module.SchDoc]

### Sub-sheets
Interface_Voltage_Sensor_2 = Interface_Voltage_Sensor_1.SchDoc: GND, +3.3V, VLT_SGN, KVCC, KGND, VLT_SNS (harness VLT SENSE)
nterface_Voltage_Sensor_1 = Interface_Voltage_Sensor_1.SchDoc: GND, +3.3V, VLT_SGN, KGND, KVCC, VLT_SNS (harness VLT SENSE)

### Ports
+3.3V, GKART, GND, VKART, VLT_DATA (in, harness VOLTAGE DATA), VLT_SNS (harness VLT)

### Harnesses
VOLTAGE DATA: VLT_1_DIG, VLT_2_DIG
VLT: VLT1_SNS, VLT2_SNS

### Nets
+3.3V: port +3.3V, sheet Interface_Voltage_Sensor_2/+3.3V, sheet nterface_Voltage_Sensor_1/+3.3V
GKART: port GKART, sheet Interface_Voltage_Sensor_2/KGND, sheet nterface_Voltage_Sensor_1/KGND
GND: port GND, sheet Interface_Voltage_Sensor_2/GND, sheet nterface_Voltage_Sensor_1/GND
VKART: port VKART, sheet Interface_Voltage_Sensor_2/KVCC, sheet nterface_Voltage_Sensor_1/KVCC  [project net KVCC]
VLT_1_DIG: sheet nterface_Voltage_Sensor_1/VLT_SGN, port VLT_DATA.VLT_1_DIG  [project net VLT_1]
VLT_2_DIG: sheet Interface_Voltage_Sensor_2/VLT_SGN, port VLT_DATA.VLT_2_DIG

### Buses and harness runs
harness VLT1_SNS = sheet nterface_Voltage_Sensor_1/VLT_SNS
harness VLT2_SNS = sheet Interface_Voltage_Sensor_2/VLT_SNS

### Notes on the sheet
- Voltage Sensing Module
- Input Power Ports
- Voltage Sensors Interfaces
- Data Output Signals
- Sensor Signals RTD

## Sheet Interface_Voltage_Sensor_1.SchDoc
size A3; SPICEModelCacheHXNSQRAW: <root> / <DocumentId>HXNSQRAW</DocumentId> / </root>
Used 2 times, as channels U_Voltage_Sensing_Module/Interface_Voltage_Sensor_2, U_Voltage_Sensing_Module/nterface_Voltage_Sensor_1. Parts and nets are listed once, with the designators drawn on the sheet.
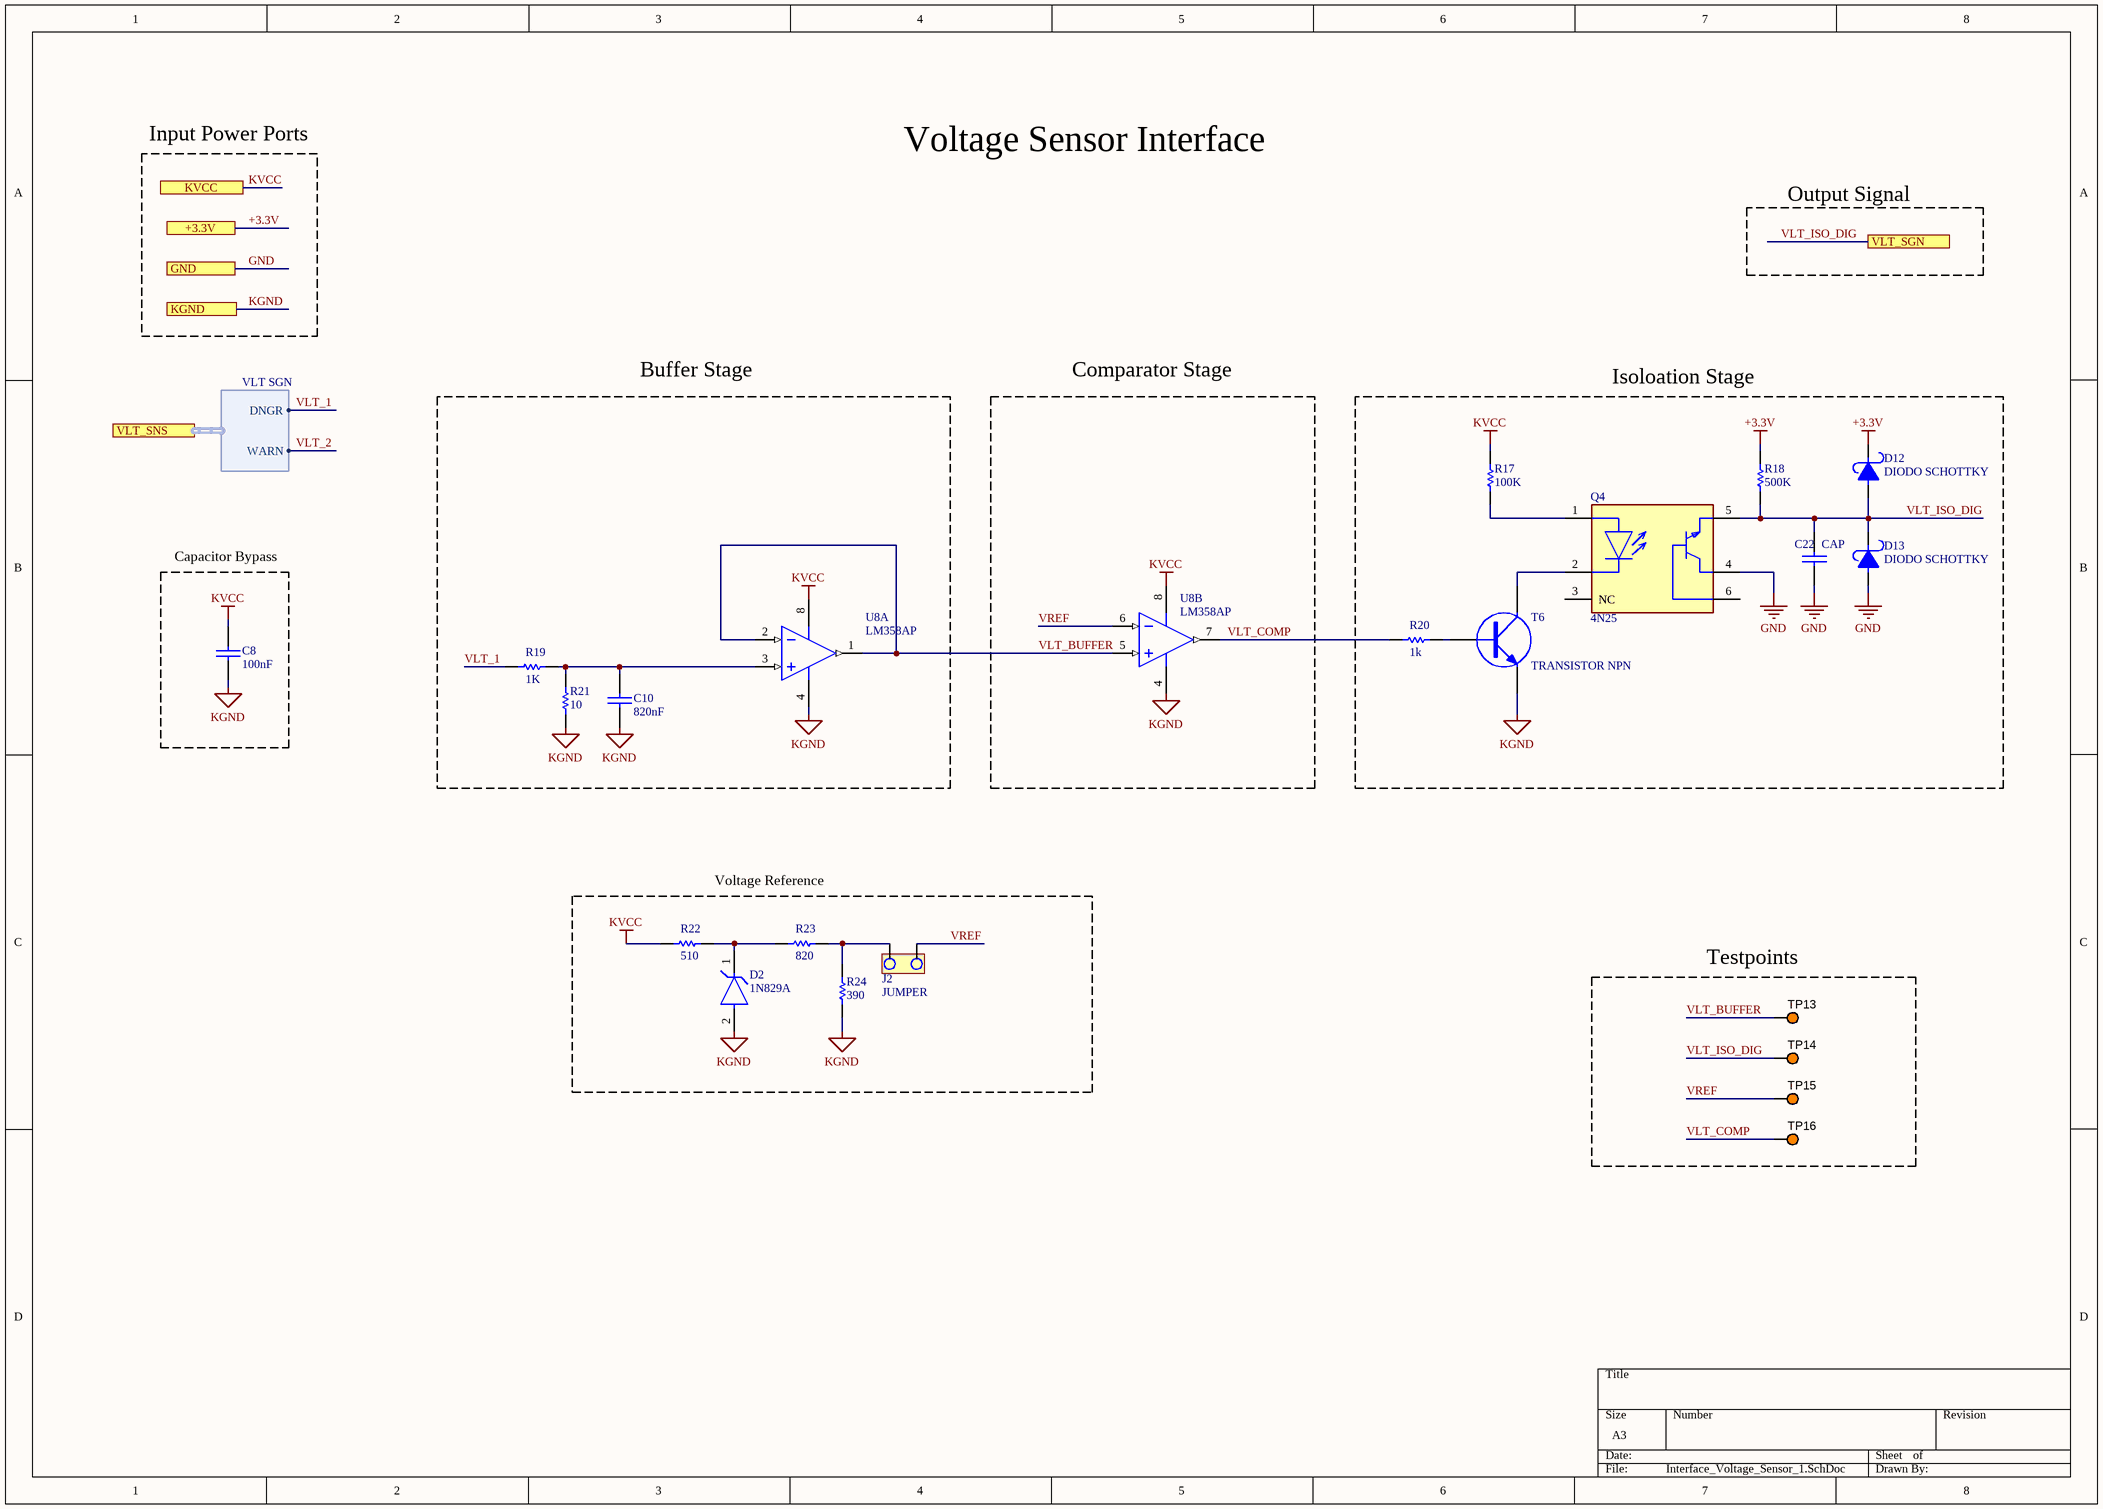
[diagram p9: Interface_Voltage_Sensor_1.SchDoc]

### Parts
C8  100nF  [CAP200]
C10  820nF  [CAP200]
C22  CAP  [CAP200]
D2  1N829A  [FP-DO-35-MFG]
D12  DIODO SCHOTTKY  [DO41]
D13  DIODO SCHOTTKY  [DO41]
J2  JUMPER  [JUMPER2]
Q4  4N25  [FP-4N25-MFG]
R17  100K  [RES400]
R18  500K  [RES400]
R19  1K  [RES400]
R20  1k  [RES400]
R21  10  [RES400]
R22  510  [RES400]
R23  820  [RES400]
R24  390  [RES400]
T6  TRANSISTOR NPN  [TO92]
TP13  5003  [KSTN-5003]  (value not drawn)
TP14  5003  [KSTN-5003]  (value not drawn)
TP15  5003  [KSTN-5003]  (value not drawn)
TP16  5003  [KSTN-5003]  (value not drawn)
U8  LM358AP  [P0008A]  (parts A,B of 2)

### Blocks framed on the sheet
Buffer Stage: C10 R19 R21 U8
Comparator Stage: U8
Isoloation Stage: C22 D12 D13 Q4 R17 R18 R20 T6
Capacitor Bypass: C8
Voltage Reference: D2 J2 R22-R24
Testpoints: TP13-TP16

### Ports
+3.3V, GND, KGND, KVCC, VLT_SGN, VLT_SNS (harness VLT SGN)

### Harnesses
VLT SGN: WARN, DNGR

### Nets
+3.3V: D12.2 R18.2 ; port +3.3V
GND: C22.2 D13.1 Q4.4(E) ; port GND
KGND: C8.2 C10.2 D2.2(A) R21.1 R24.1 T6.3(E) U8.4(GND) ; port KGND
KVCC: C8.1 R17.2 R22.1 U8.8(VCC) ; port KVCC
VLT_1: R19.1 ; port VLT_SNS.DNGR
VLT_2: port VLT_SNS.WARN
VLT_BUFFER: TP13.1 U8.1(1OUT) U8.2(1IN-) U8.5(2IN+)
VLT_COMP: R20.1 TP16.1 U8.7(2OUT)
VLT_ISO_DIG: C22.1 D12.1 D13.2 Q4.5(C) R18.1 TP14.1 ; port VLT_SGN
VREF: J2.2 TP15.1 U8.6(2IN-)
NetC10_1: C10.1 R19.2 R21.2 U8.3(1IN+)
NetD2_1: D2.1(C) R22.2 R23.1
NetJ2_1: J2.1 R23.2 R24.2
NetQ4_1: Q4.1(A) R17.1
NetQ4_2: Q4.2(C) T6.2(C)
NetR20_2: R20.2 T6.1(B)

Not connected (* = marked no-connect by the designer): Q4 3(NC) 6(B)

### Channels
U_Voltage_Sensing_Module/Interface_Voltage_Sensor_2: designators end in _Interface_Voltage_Sensor_2; ports +3.3V=+3.3V GND=GND KGND=GKART KVCC=KVCC VLT_SGN=VLT_2_DIG
U_Voltage_Sensing_Module/nterface_Voltage_Sensor_1: designators end in _nterface_Voltage_Sensor_1; ports +3.3V=+3.3V GND=GND KGND=GKART KVCC=KVCC VLT_SGN=VLT_1

### Buses and harness runs
harness  = port VLT_SNS

### Notes on the sheet
- Input Power Ports
- Voltage Sensor Interface
- Output Signal

### Library data of the parts
C8 C10 = CAP
D2 = CMP-004-00078-1: Zener Diode, 6.2V V(Z), 4.84%, 0.5W, Silicon, DO-204AA
Q4 = CMP-00026-00001-1: VISHAY 4N25 Transistor Output Optocoupler, 1 Channel, DIP, 6 Pins, 60 mA, 5 kV, 20 %
R17-R24 = CMP-009-00195-1: Component Type: Standard; Source: Schematics.SchLib; Pins: 2; Design Item ID: RES
T6 = CMP-012-00019-1: Component Type: Standard; Source: Schematics.SchLib; Design Item ID: TRANSISTOR NPN; Pins: 3
TP13-TP16 = CMP-002-00037-2: as TP5 on sheet Interface_Current_Sensor_1; Colour: Orange; Packaging: Bulk; Package Description: 1-Pin Through Hole Device, Dia 2.54 mm; Pins: 1; Package Reference: 5003; Datasheet Version: Jun-15; Case/Package: 5003; Mounting Technology: TH; Connector Type: TestPoint; Diameter: 2.54mm; Contact Material: Bronze; Datasheet URL: http://keyelco.com/userAssets/file/M65p56.pdf; Manufacturer URL: http://www.keyelco.com/; Package Quantity: 10; Contact Plating: Tin; RoHS Compliant: True
U8 = CMP-014-00023-2: as U7 on sheet Interface_Current_Sensor_2; Case/Package: DIP; Max Operating Temperature: 70°C; RoHS Compliant: True; Manufacturer URL: http://www.ti.com/; Pins: 8; Package Description: 8-Pin Double In-line Package, Body 9.59 x 6.35 mm, Pitch 2.54 mm; Datasheet URL: http://www.ti.com/lit/ds/symlink/lm358a.pdf; Max Supply Voltage: 16V; Package Reference: P0008A; Mounting Technology: TH; Min Operating Temperature: 0°C; Package URL: http://www.ti.com/lit/ml/mpdi001b/mpdi001b.pdf; Min Supply Voltage: 1.5V; Package Quantity: 50; Packaging: Rail/Tube; Datasheet Version: SLOS068T, 04/2015; Nominal Gain Bandwith Product: 700KHz

## Sheet Interface_Accelerometer_1.SchDoc
size A4
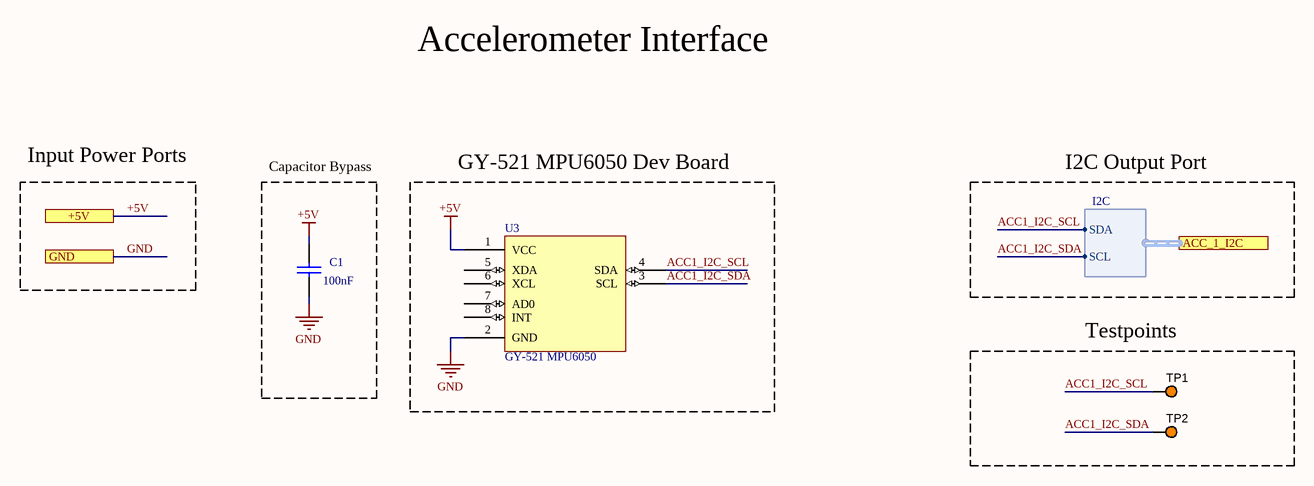
[diagram p10: Interface_Accelerometer_1.SchDoc]

### Parts
C1  100nF  [CAP200]
TP1  5003  [KSTN-5003]  (value not drawn)
TP2  5003  [KSTN-5003]  (value not drawn)
U3  GY-521 MPU6050  [GY-521 MPU6050]

### Blocks framed on the sheet
Capacitor Bypass: C1
GY-521 MPU6050 Dev Board: U3
Testpoints: TP1 TP2

### Ports
+5V, ACC_1_I2C (harness I2C), GND

### Harnesses
I2C: SDA, SCL

### Nets
+5V: C1.1 U3.1(VCC) ; port +5V
GND: C1.2 U3.2(GND) ; port GND
ACC1_I2C_SCL: TP1.1 U3.4(SDA) ; port ACC_1_I2C.SDA
ACC1_I2C_SDA: TP2.1 U3.3(SCL) ; port ACC_1_I2C.SCL

Not connected (* = marked no-connect by the designer): U3 5(XDA) 6(XCL) 7(AD0) 8(INT)

### Notes on the sheet
- Accelerometer Interface
- Input Power Ports
- I2C Output Port

### Library data of the parts
C1 = CAP
TP1 TP2 = CMP-002-00037-2: as TP5 on sheet Interface_Current_Sensor_1; Colour: Orange; Packaging: Bulk; Package Description: 1-Pin Through Hole Device, Dia 2.54 mm; Pins: 1; Package Reference: 5003; Datasheet Version: Jun-15; Case/Package: 5003; Mounting Technology: TH; Connector Type: TestPoint; Diameter: 2.54mm; Contact Material: Bronze; Datasheet URL: http://keyelco.com/userAssets/file/M65p56.pdf; Manufacturer URL: http://www.keyelco.com/; Package Quantity: 10; Contact Plating: Tin; RoHS Compliant: True
U3 = GY-521 MPU6050: 3 Axis Accelerometer Gyroscope Module 6 DOF 6-Axis Acceleration Sensor Gyroscope Sensor Module 16 Bit AD Converter Data Output IIC for Arduino

## Sheet Interface_Accelerometer_2.SchDoc
size A4
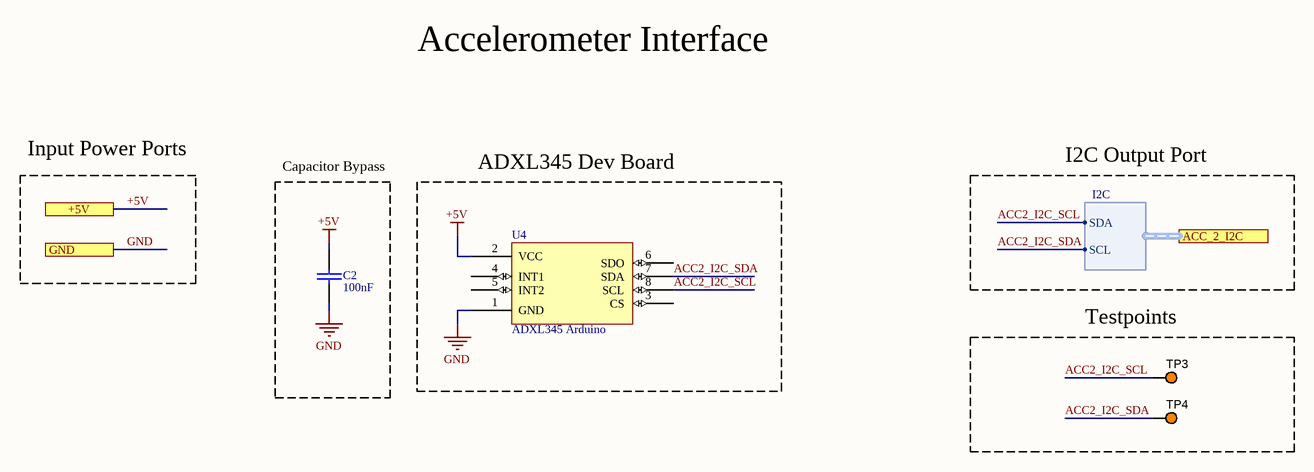
[diagram p11: Interface_Accelerometer_2.SchDoc]

### Parts
C2  100nF  [CAP200]
TP3  5003  [KSTN-5003]  (value not drawn)
TP4  5003  [KSTN-5003]  (value not drawn)
U4  ADXL345 Arduino  [GY-521 MPU6050]

### Blocks framed on the sheet
Capacitor Bypass: C2
ADXL345 Dev Board: U4
Testpoints: TP3 TP4

### Ports
+5V, ACC_2_I2C (harness I2C), GND

### Harnesses
I2C: SDA, SCL

### Nets
+5V: C2.1 U4.2(VCC) ; port +5V
GND: C2.2 U4.1(GND) ; port GND
ACC2_I2C_SCL: TP3.1 U4.8(SCL) ; port ACC_2_I2C.SDA
ACC2_I2C_SDA: TP4.1 U4.7(SDA) ; port ACC_2_I2C.SCL

Not connected (* = marked no-connect by the designer): U4 3(CS) 4(INT1) 5(INT2) 6(SDO)

### Notes on the sheet
- Accelerometer Interface
- Input Power Ports
- I2C Output Port

### Library data of the parts
C2 = CAP
TP3 TP4 = CMP-002-00037-2: as TP5 on sheet Interface_Current_Sensor_1; Colour: Orange; Packaging: Bulk; Package Description: 1-Pin Through Hole Device, Dia 2.54 mm; Pins: 1; Package Reference: 5003; Datasheet Version: Jun-15; Case/Package: 5003; Mounting Technology: TH; Connector Type: TestPoint; Diameter: 2.54mm; Contact Material: Bronze; Datasheet URL: http://keyelco.com/userAssets/file/M65p56.pdf; Manufacturer URL: http://www.keyelco.com/; Package Quantity: 10; Contact Plating: Tin; RoHS Compliant: True
U4 = ADXL345 Arduino: 3-axis accelerometer with high resolution (13-bit) measurement at up to ±16 g. Digital output data is formatted as 16-bit twos complement and is accessible through SPI or I2C digital interface.

## Sheet Interace_PT100.SchDoc
size A2; SPICEModelCacheGZELQBNJ: <root> / <DocumentId>GZELQBNJ</DocumentId> / </root>
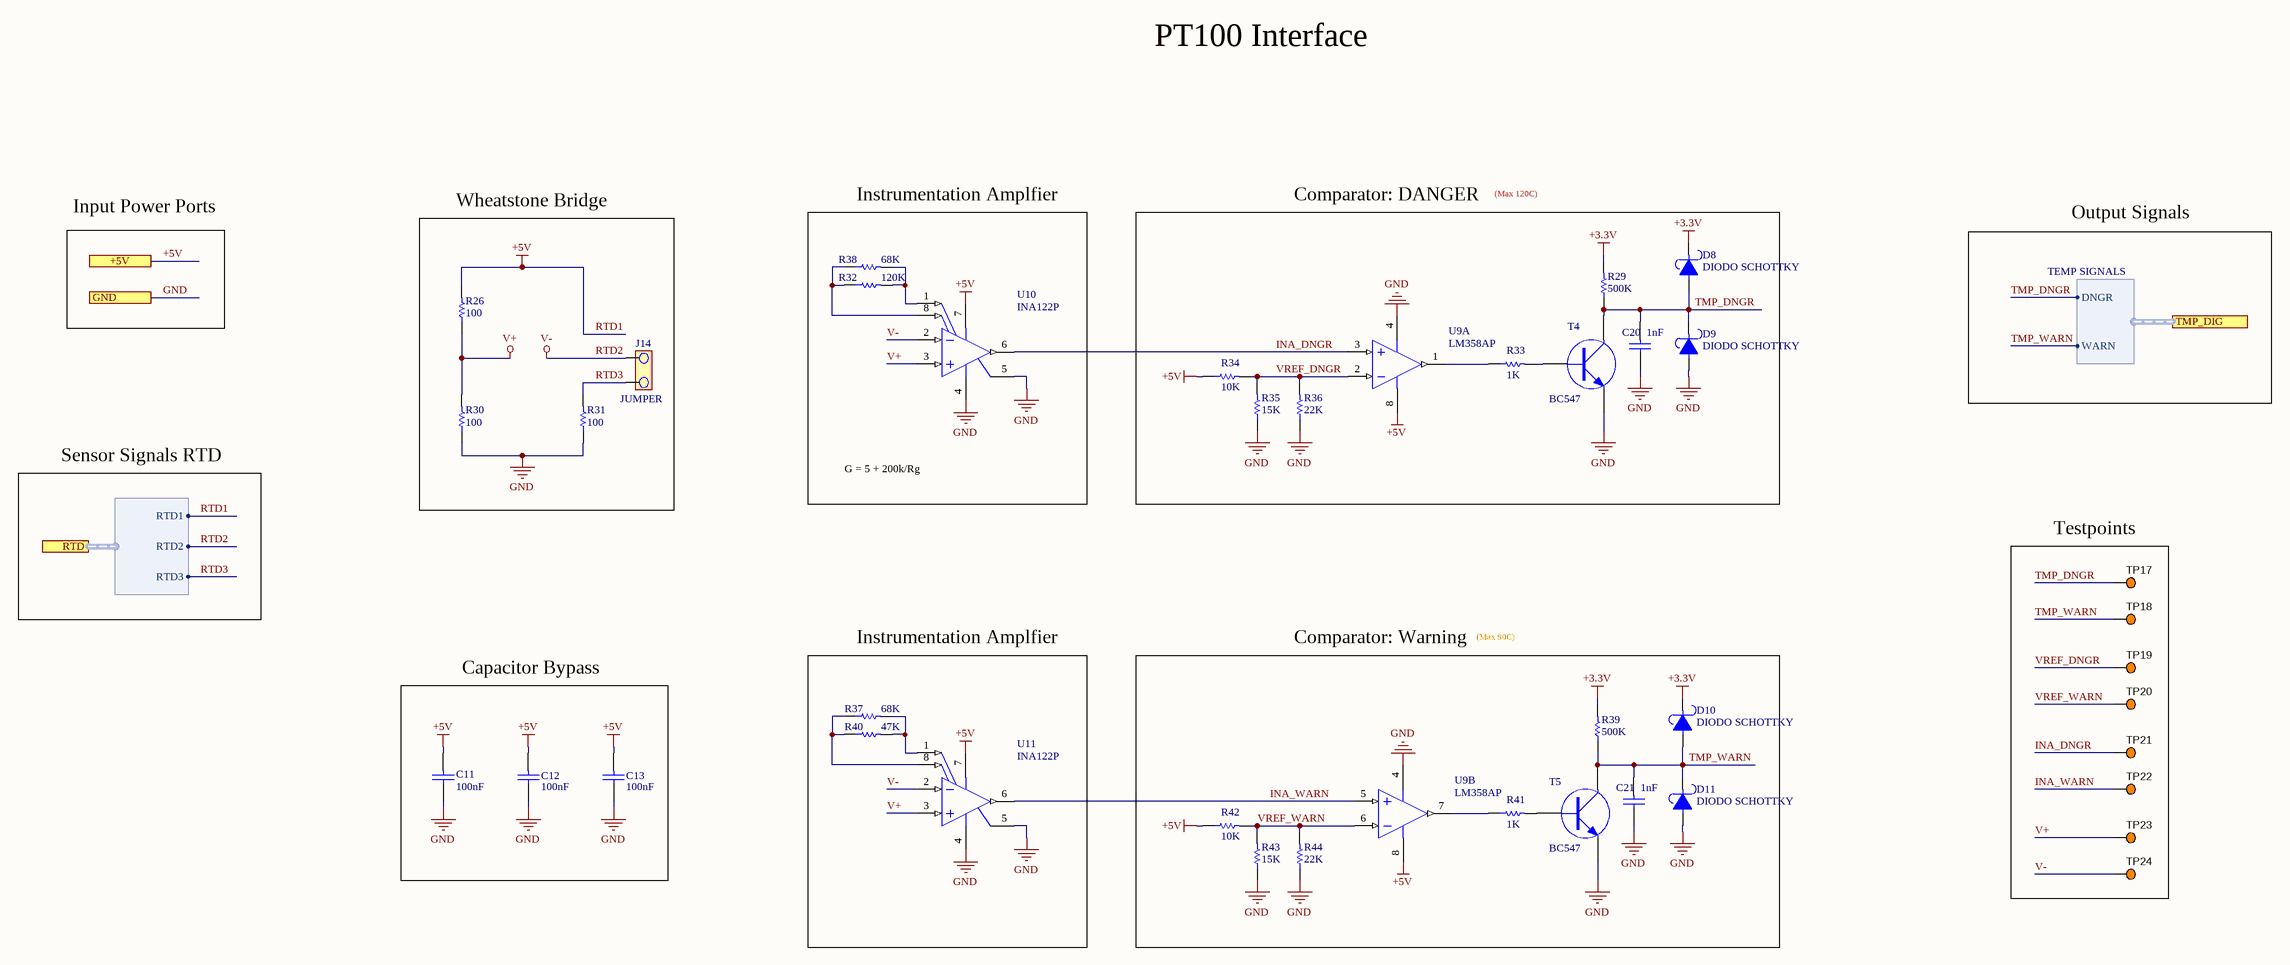
[diagram p12: Interace_PT100.SchDoc]

### Parts
C11  100nF  [CAP200]
C12  100nF  [CAP200]
C13  100nF  [CAP200]
C20  1nF  [CAP200]
C21  1nF  [CAP200]
D8  DIODO SCHOTTKY  [DO41]
D9  DIODO SCHOTTKY  [DO41]
D10  DIODO SCHOTTKY  [DO41]
D11  DIODO SCHOTTKY  [DO41]
J14  JUMPER  [JUMPER2]
R26  100  [RES400]
R29  500K  [RES400]
R30  100  [RES400]
R31  100  [RES400]
R32  120K  [RES400]
R33  1K  [RES400]
R34  10K  [RES400]
R35  15K  [RES400]
R36  22K  [RES400]
R37  68K  [RES400]
R38  68K  [RES400]
R39  500K  [RES400]
R40  47K  [RES400]
R41  1K  [RES400]
R42  10K  [RES400]
R43  15K  [RES400]
R44  22K  [RES400]
T4  BC547  [TO92]
T5  BC547  [TO92]
TP17  5003  [KSTN-5003]  (value not drawn)
TP18  5003  [KSTN-5003]  (value not drawn)
TP19  5003  [KSTN-5003]  (value not drawn)
TP20  5003  [KSTN-5003]  (value not drawn)
TP21  5003  [KSTN-5003]  (value not drawn)
TP22  5003  [KSTN-5003]  (value not drawn)
TP23  5003  [KSTN-5003]  (value not drawn)
TP24  5003  [KSTN-5003]  (value not drawn)
U9  LM358AP  [P0008A]  (parts A,B of 2)
U10  INA122P  [P0008A]
U11  INA122P  [P0008A]

### Blocks framed on the sheet
Instrumentation Amplfier: R32 R38 U10
Comparator: DANGER: C20 D8 D9 R29 R33-R36 T4 U9
Wheatstone Bridge: J14 R26 R30 R31
Testpoints: TP17-TP24
Capacitor Bypass: C11-C13
Instrumentation Amplfier: R37 R40 U11
Comparator: Warning: C21 D10 D11 R39 R41-R44 T5 U9

### Ports
+5V, GND, RTD (harness RTD), TMP_DIG (harness TEMP SIGNALS)

### Harnesses
?: RTD1, RTD2, RTD3
TEMP SIGNALS: WARN, DNGR

### Nets
+3.3V: D8.2 D10.2 R29.2 R39.2
+5V: C11.1 C12.1 C13.1 R26.2 R34.1 R42.1 U9.8(VCC) U10.7(V+) U11.7(V+) ; port +5V, port RTD.RTD1  [also labelled RTD1]
GND: C11.2 C12.2 C13.2 C20.2 C21.2 D9.1 D11.1 R30.1 R31.1 R35.1 R36.1 R43.1 R44.1 T4.3(E) T5.3(E) U9.4(GND) U10.4(V-) U10.5(REF) U11.4(V-) U11.5(REF) ; port GND
RTD2: J14.2 TP24.1 U10.2(VIN-) U11.2(VIN-) ; port RTD.RTD2  [also labelled V-]
V+: R26.1 R30.2 TP23.1 U10.3(VIN+) U11.3(VIN+)
INA_DNGR: TP21.1 U9.3(1IN+) U10.6(VO)
INA_WARN: TP22.1 U9.5(2IN+) U11.6(VO)
RTD3: J14.1 R31.2 ; port RTD.RTD3
TMP_DNGR: C20.1 D8.1 D9.2 R29.1 T4.2(C) TP17.1 ; port TMP_DIG.DNGR
TMP_WARN: C21.1 D10.1 D11.2 R39.1 T5.2(C) TP18.1 ; port TMP_DIG.WARN
VREF_DNGR: R34.2 R35.2 R36.2 TP19.1 U9.2(1IN-)
VREF_WARN: R42.2 R43.2 R44.2 TP20.1 U9.6(2IN-)
NetR32_1: R32.1 R38.1 U10.8(RG)
NetR32_2: R32.2 R38.2 U10.1(RG)
NetR33_1: R33.1 U9.1(1OUT)
NetR33_2: R33.2 T4.1(B)
NetR37_1: R37.1 R40.1 U11.8(RG)
NetR37_2: R37.2 R40.2 U11.1(RG)
NetR41_1: R41.1 U9.7(2OUT)
NetR41_2: R41.2 T5.1(B)

### Notes on the sheet
- PT100 Interface
- Input Power Ports
- (Max 120C)
- Output Signals
- Sensor Signals RTD
- G = 5 + 200k/Rg
- (Max 90C)

### Library data of the parts
C11-C13 C20 C21 = CAP
J14 = CMP-043-000055-1: Pin Count: 2; Source: Schematics.SchLib; Design Item ID: JUMPER; Component Type: Standard
R26 R29-R44 = CMP-009-00195-1: Component Type: Standard; Source: Schematics.SchLib; Pins: 2; Design Item ID: RES
T4 T5 = CMP-012-00019-1: Component Type: Standard; Source: Schematics.SchLib; Design Item ID: TRANSISTOR NPN; Pins: 3
TP17-TP24 = CMP-002-00037-2: as TP5 on sheet Interface_Current_Sensor_1; Colour: Orange; Packaging: Bulk; Package Description: 1-Pin Through Hole Device, Dia 2.54 mm; Pins: 1; Package Reference: 5003; Datasheet Version: Jun-15; Case/Package: 5003; Mounting Technology: TH; Connector Type: TestPoint; Diameter: 2.54mm; Contact Material: Bronze; Datasheet URL: http://keyelco.com/userAssets/file/M65p56.pdf; Manufacturer URL: http://www.keyelco.com/; Package Quantity: 10; Contact Plating: Tin; RoHS Compliant: True
U9 = CMP-014-00023-2: as U7 on sheet Interface_Current_Sensor_2; Case/Package: DIP; Max Operating Temperature: 70°C; RoHS Compliant: True; Manufacturer URL: http://www.ti.com/; Pins: 8; Package Description: 8-Pin Double In-line Package, Body 9.59 x 6.35 mm, Pitch 2.54 mm; Datasheet URL: http://www.ti.com/lit/ds/symlink/lm358a.pdf; Max Supply Voltage: 16V; Package Reference: P0008A; Mounting Technology: TH; Min Operating Temperature: 0°C; Package URL: http://www.ti.com/lit/ml/mpdi001b/mpdi001b.pdf; Min Supply Voltage: 1.5V; Package Quantity: 50; Packaging: Rail/Tube; Datasheet Version: SLOS068T, 04/2015; Nominal Gain Bandwith Product: 700KHz
U10 U11 = CMP-014-00006-1: Instrumentation Amplifier, 1 Func, 250uV Offset-Max, 0.12MHz Band Width, PDIP8; Qualification Status: Not Qualified; Bandwidth (3dB)-Nom: 120kHz; Max Supply Current: 85uA; Supply Voltage Limit-Max: 18V; Voltage Gain-Max: 10000; Surface Mount: No; Slew Rate: 0.08V/µs; Non-linearity-Max: 0.012%; Package Body Material: Plastic; Voltage Gain-Min: 5; Input Offset Current-Max (IIO): 2nA; Neg Supply Voltage Limit-Max: -18V; Channels: 1; Common Mode Rejection Ratio-Min: 83dB; Power Supplies: 2.2/36/+-18V; Nominal Supply Voltage: 15V; Average Bias Current-Max (IIB): -25nA; Voltage Gain-Nom: 100; Package Equivalence Code: DIP8,.3; Pins: 8; Min Operating Temperature: -40°C; Terminal Position: DUAL; JESD-30 Code: R-PDIP-T8; Reach SVHC Compliant: Yes; Max Operating Temperature: 85°C; Case/Package: DIP; Package Style: IN-LINEMeter; RoHS Compliant: Yes; Terminal Pitch: 2.54mm; Height - Seated (Max): 5.08mm; Length: 9.81mm; JESD-609 Code: e4; Terminal Form: Through Hole; Terminal Finish: Nickel; Amplifier Type: INSTRUMENTATION AMPLIFIER; Package Shape: Rectangular; Width: 7.62mm; Temperature Grade: INDUSTRIAL; Input Offset Voltage-Max: 250uV

## Sheet Interface_DS18B20.SchDoc
size A4
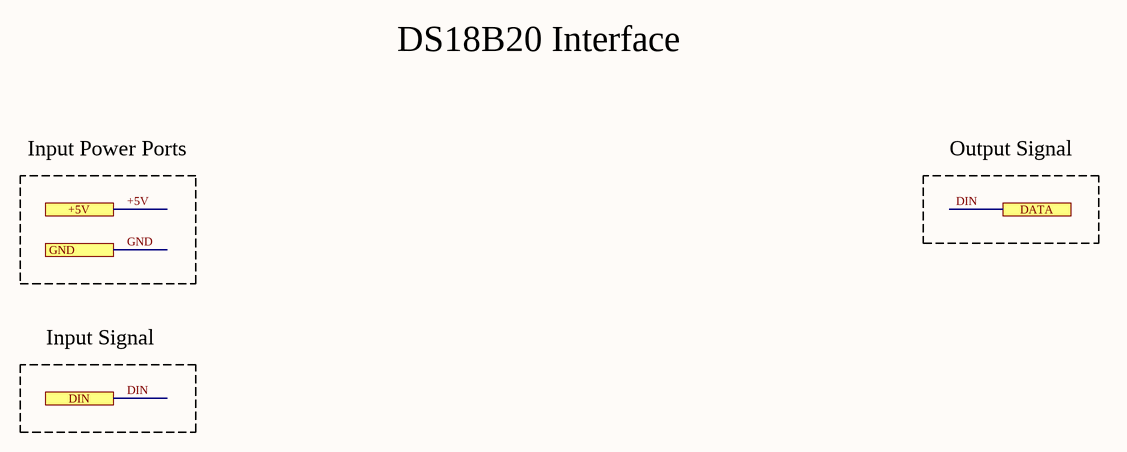
[diagram p13: Interface_DS18B20.SchDoc]

### Ports
+5V, DATA, DIN, GND

### Nets
+5V: port +5V
DIN: port DATA, port DIN
GND: port GND

### Notes on the sheet
- DS18B20 Interface
- Input Power Ports
- Output Signal
- Input Signal

## Nets that join several sheets
+3.3V: Control_Processing_Unit (C9.1 C14.1 U2#2.2), Interface_Current_Sensor_2 (D4.2 D6.2 R12.2 R16.2), U_CAN_Activity_Module/Interface_CAN_1 (D1_Interface_CAN_1.2 R4_Interface_CAN_1.2), U_CAN_Activity_Module/Interface_CAN_2 (D1_Interface_CAN_2.2 R4_Interface_CAN_2.2), Connectors (DZ2.2 Q2.3), U_Voltage_Sensing_Module/Interface_Voltage_Sensor_2 (D12_Interface_Voltage_Sensor_2.2 R18_Interface_Voltage_Sensor_2.2), U_Voltage_Sensing_Module/nterface_Voltage_Sensor_1 (D12_nterface_Voltage_Sensor_1.2 R18_nterface_Voltage_Sensor_1.2), Interace_PT100 (D8.2 D10.2 R29.2 R39.2)
+5V: Control_Processing_Unit (C15.1 C16.1 U2#1.J5_1), Interface_Current_Sensor_1 (C3.1 U5.1), Interface_Current_Sensor_2 (6 pins), U_CAN_Activity_Module/Interface_CAN_1 (C5_Interface_CAN_1.1 R8_Interface_CAN_1.1 R10_Interface_CAN_1.1 U6_Interface_CAN_1.8), U_CAN_Activity_Module/Interface_CAN_2 (C5_Interface_CAN_2.1 R8_Interface_CAN_2.1 R10_Interface_CAN_2.1 U6_Interface_CAN_2.8), Connectors (DZ1.2 J4#2.4 J8.1 Q1.3), Interface_Accelerometer_1 (C1.1 U3.1), Interface_Accelerometer_2 (C2.1 U4.2), Interace_PT100 (9 pins)
GKART: Connectors (J9.1), U_Voltage_Sensing_Module/Interface_Voltage_Sensor_2 (7 pins), U_Voltage_Sensing_Module/nterface_Voltage_Sensor_1 (7 pins)
GND: Control_Processing_Unit (8 pins), Interface_Current_Sensor_1 (C3.2 U5.2), Interface_Current_Sensor_2 (10 pins), U_CAN_Activity_Module/Interface_CAN_1 (8 pins), U_CAN_Activity_Module/Interface_CAN_2 (8 pins), Connectors (7 pins), U_Voltage_Sensing_Module/Interface_Voltage_Sensor_2 (C22_Interface_Voltage_Sensor_2.2 D13_Interface_Voltage_Sensor_2.1 Q4_Interface_Voltage_Sensor_2.4), U_Voltage_Sensing_Module/nterface_Voltage_Sensor_1 (C22_nterface_Voltage_Sensor_1.2 D13_nterface_Voltage_Sensor_1.1 Q4_nterface_Voltage_Sensor_1.4), Interface_Accelerometer_1 (C1.2 U3.2), Interface_Accelerometer_2 (C2.2 U4.1), Interace_PT100 (20 pins)
KVCC: Connectors (J9.2), U_Voltage_Sensing_Module/Interface_Voltage_Sensor_2 (C8_Interface_Voltage_Sensor_2.1 R17_Interface_Voltage_Sensor_2.2 R22_Interface_Voltage_Sensor_2.1 U8_Interface_Voltage_Sensor_2.8), U_Voltage_Sensing_Module/nterface_Voltage_Sensor_1 (C8_nterface_Voltage_Sensor_1.1 R17_nterface_Voltage_Sensor_1.2 R22_nterface_Voltage_Sensor_1.1 U8_nterface_Voltage_Sensor_1.8)
CAN_1_H: U_CAN_Activity_Module/Interface_CAN_1 (R7_Interface_CAN_1.1), Connectors (J7.2)
CAN_1_L: U_CAN_Activity_Module/Interface_CAN_1 (R5_Interface_CAN_1.1), Connectors (J7.1)
CAN_2_H: U_CAN_Activity_Module/Interface_CAN_2 (R7_Interface_CAN_2.1), Connectors (J10.2)
CAN_2_L: U_CAN_Activity_Module/Interface_CAN_2 (R5_Interface_CAN_2.1), Connectors (J10.1)
CUR_1_VAL: Control_Processing_Unit (U2#1.J5_5), Interface_Current_Sensor_1 (J1.2 TP5.1)
CUR_2_VAL: Interface_Current_Sensor_2 (TP10.1 U7.3 U7.5), Connectors (J4#2.2)
ESP_CAN_OUT: Control_Processing_Unit (U2#1.J5_10), Connectors (J15.4)
ESP_CUR_OUT: Control_Processing_Unit (U2#1.J5_9), Connectors (J15.3)
ESP_TMP_OUT: Control_Processing_Unit (U2#1.J5_7), Connectors (J15.1)
ESP_VLT_OUT: Control_Processing_Unit (U2#1.J5_8), Connectors (J15.2)
FPGA_CAN_OUT: Control_Processing_Unit (U2#2.34), Connectors (J17.4)
FPGA_CUR_OUT: Control_Processing_Unit (U2#2.35), Connectors (J17.3)
FPGA_TMP_OUT: Control_Processing_Unit (U2#2.37), Connectors (J17.1)
FPGA_VLT_OUT: Control_Processing_Unit (U2#2.36), Connectors (J17.2)
VLT1_SNS.DNGR: Connectors (J6.2), U_Voltage_Sensing_Module/nterface_Voltage_Sensor_1 (R19_nterface_Voltage_Sensor_1.1)
VLT2_SNS.DNGR: Connectors (J13.2), U_Voltage_Sensing_Module/Interface_Voltage_Sensor_2 (R19_Interface_Voltage_Sensor_2.1)
VLT_1: Control_Processing_Unit (U2#1.J4_16), U_Voltage_Sensing_Module/nterface_Voltage_Sensor_1 (6 pins)